# Altium project slave-12-ltc6811-1.PrjPcb (part 1 of 4)
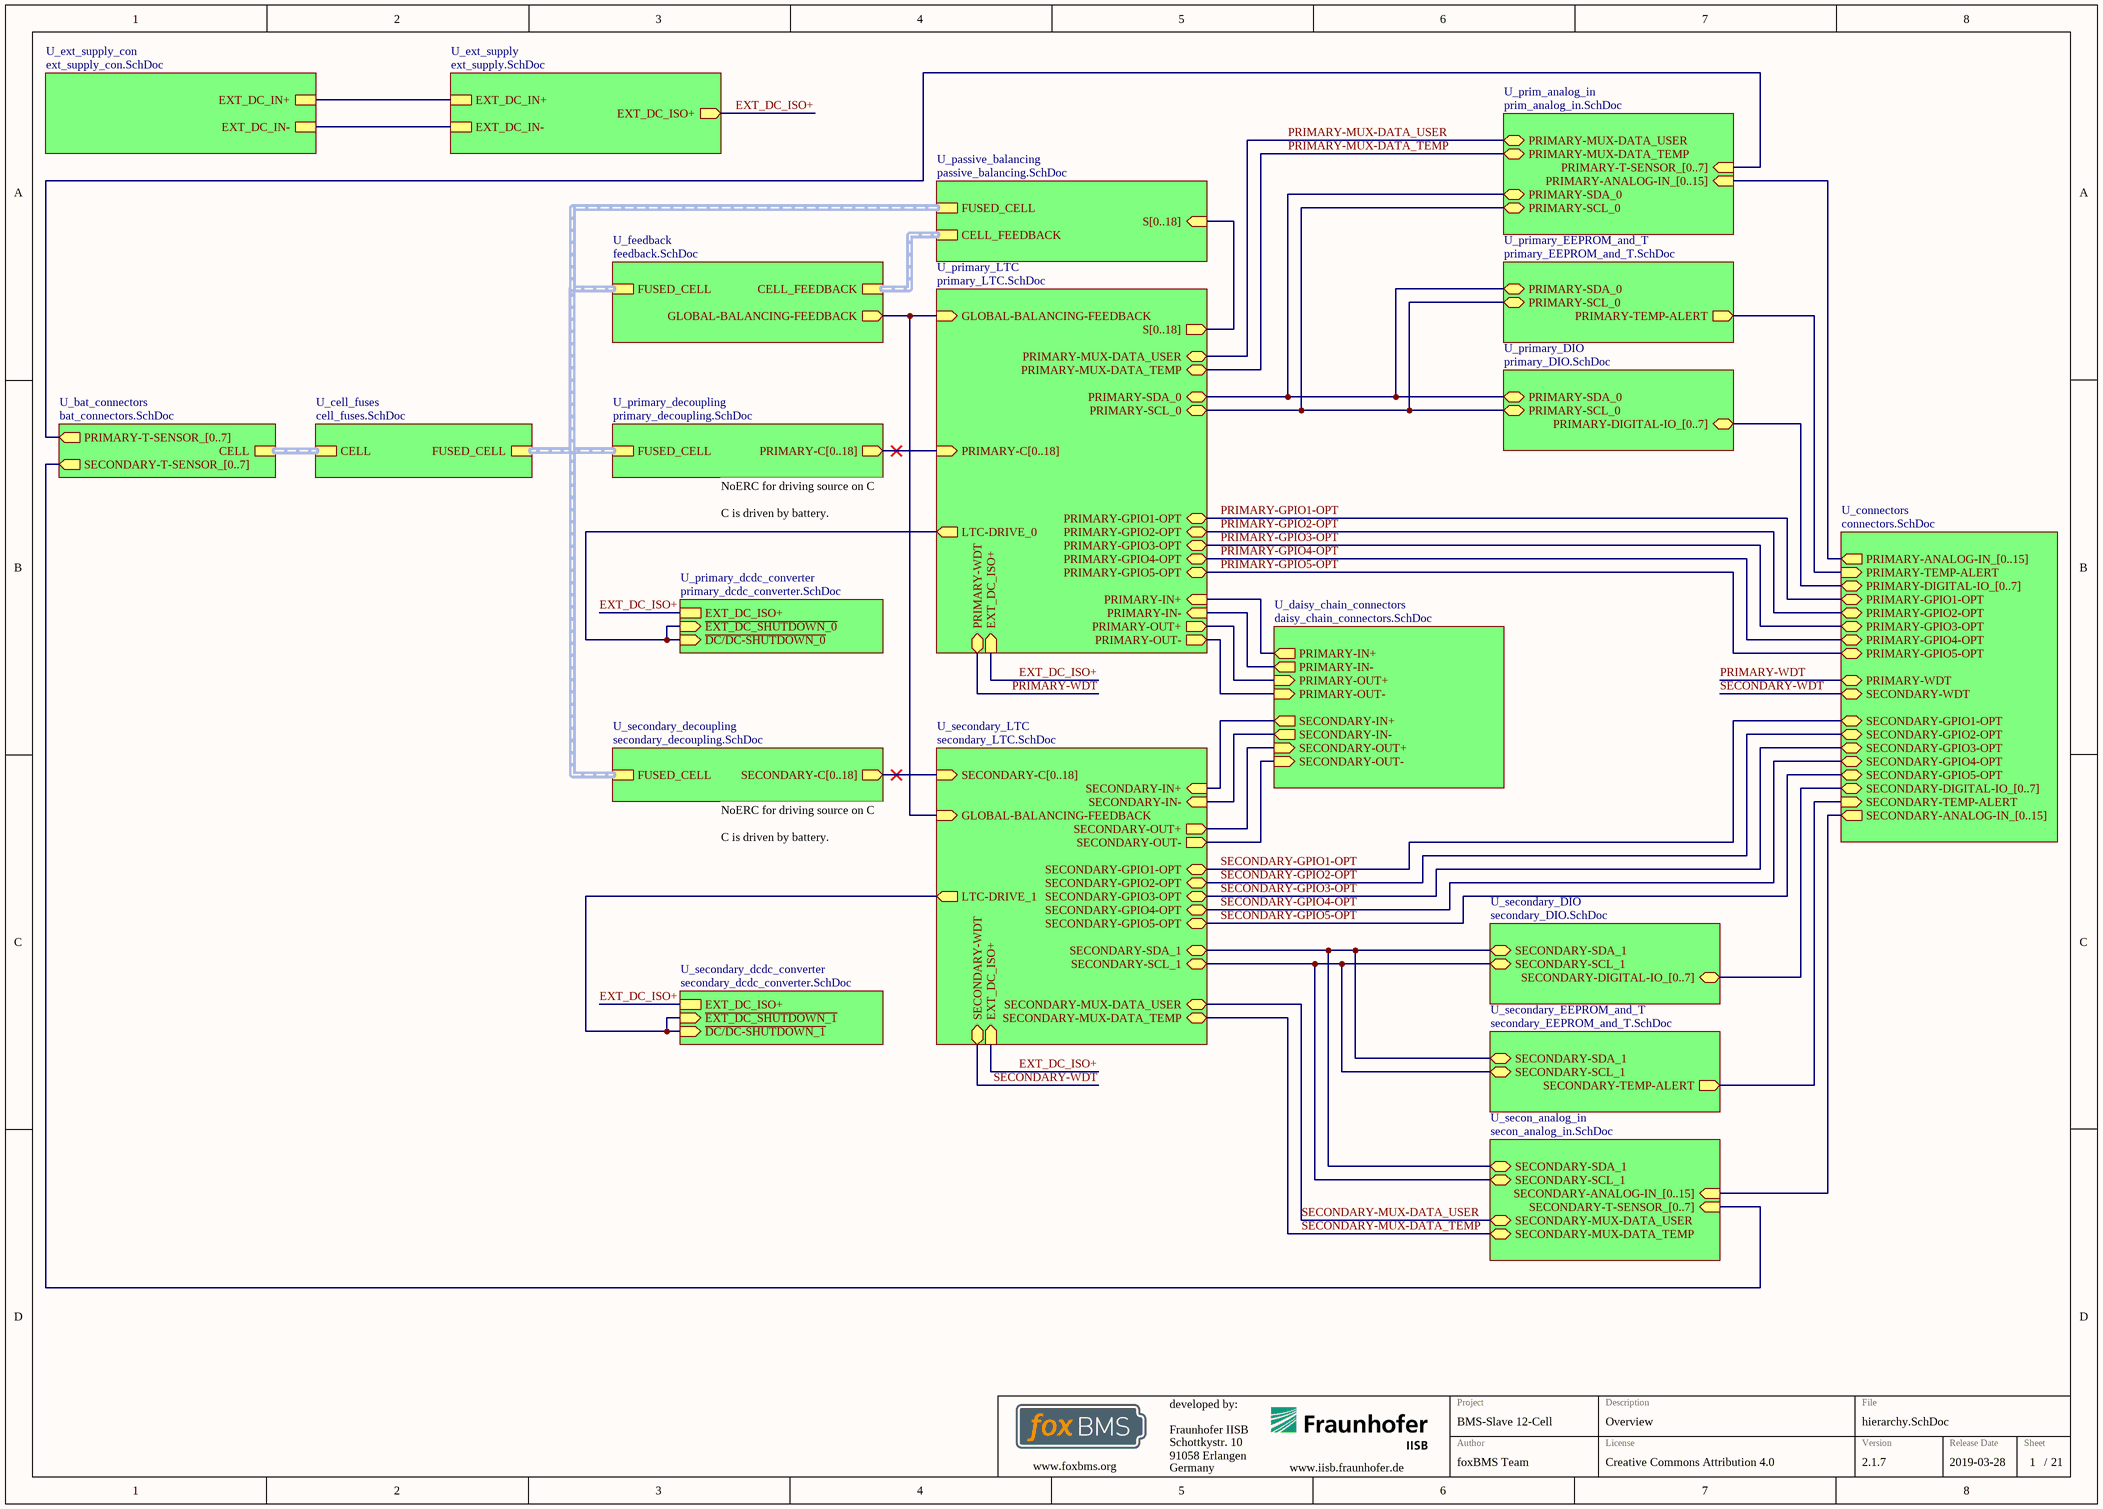
[diagram p0: hierarchy.SchDoc]
GlobalDate: 2019-03-28; GlobalLicense: Creative Commons Attribution 4.0; GlobalProject: BMS-Slave 12-Cell; GlobalVersion: 2.1.7
21 sheets, 488 parts. Net scope: hierarchical (ports join the sheet entries above them; power ports are global).
Board file: slave.PcbDoc
Sheets:
  hierarchy.SchDoc
    U_cell_fuses = cell_fuses.SchDoc
    U_primary_decoupling = primary_decoupling.SchDoc
    U_secondary_decoupling = secondary_decoupling.SchDoc
    U_ext_supply = ext_supply.SchDoc
    U_connectors = connectors.SchDoc
    U_feedback = feedback.SchDoc
    U_passive_balancing = passive_balancing.SchDoc
    U_primary_LTC = primary_LTC.SchDoc
    U_secondary_LTC = secondary_LTC.SchDoc
    U_primary_DIO = primary_DIO.SchDoc
    U_secondary_DIO = secondary_DIO.SchDoc
    U_primary_EEPROM_and_T = primary_EEPROM_and_T.SchDoc
    U_secondary_EEPROM_and_T = secondary_EEPROM_and_T.SchDoc
    U_prim_analog_in = prim_analog_in.SchDoc
    U_secon_analog_in = secon_analog_in.SchDoc
    U_daisy_chain_connectors = daisy_chain_connectors.SchDoc
    U_ext_supply_con = ext_supply_con.SchDoc
    U_bat_connectors = bat_connectors.SchDoc
    U_primary_dcdc_converter = primary_dcdc_converter.SchDoc
    U_secondary_dcdc_converter = secondary_dcdc_converter.SchDoc

## Sheet hierarchy.SchDoc
size A3; DocumentNumber: 1; SheetNumber: 1; SheetTotal: 21; SheetDescription: Overview

### Sub-sheets
U_bat_connectors = bat_connectors.SchDoc: CELL (harness CELL_VOLTAGES), PRIMARY-T-SENSOR_[0..7] (out), SECONDARY-T-SENSOR_[0..7] (out)
U_cell_fuses = cell_fuses.SchDoc: CELL (harness CELL_VOLTAGES), FUSED_CELL (harness CELL_VOLTAGES)
U_connectors = connectors.SchDoc: PRIMARY-WDT (bidir), SECONDARY-WDT (bidir), PRIMARY-GPIO1-OPT (bidir), PRIMARY-GPIO2-OPT (bidir), PRIMARY-GPIO3-OPT (bidir), PRIMARY-GPIO4-OPT (bidir), PRIMARY-GPIO5-OPT (bidir), SECONDARY-GPIO1-OPT (bidir), SECONDARY-GPIO2-OPT (bidir), SECONDARY-GPIO3-OPT (bidir), SECONDARY-GPIO4-OPT (bidir), SECONDARY-GPIO5-OPT (bidir), PRIMARY-TEMP-ALERT (in), SECONDARY-TEMP-ALERT (in), SECONDARY-DIGITAL-IO_[0..7] (bidir), PRIMARY-DIGITAL-IO_[0..7] (bidir), PRIMARY-ANALOG-IN_[0..15] (out), SECONDARY-ANALOG-IN_[0..15] (out)
U_daisy_chain_connectors = daisy_chain_connectors.SchDoc: SECONDARY-IN+ (out), SECONDARY-IN- (out), SECONDARY-OUT+ (in), SECONDARY-OUT- (in), PRIMARY-IN+ (out), PRIMARY-IN- (out), PRIMARY-OUT- (in), PRIMARY-OUT+ (in)
U_ext_supply = ext_supply.SchDoc: EXT_DC_IN+, EXT_DC_IN-, EXT_DC_ISO+ (out)
U_ext_supply_con = ext_supply_con.SchDoc: EXT_DC_IN+, EXT_DC_IN-
U_feedback = feedback.SchDoc: GLOBAL-BALANCING-FEEDBACK (out), CELL_FEEDBACK (harness CELL_FEEDBACK), FUSED_CELL (harness CELL_VOLTAGES)
U_passive_balancing = passive_balancing.SchDoc: FUSED_CELL (harness CELL_VOLTAGES), S[0..18] (in), CELL_FEEDBACK (harness CELL_FEEDBACK)
U_prim_analog_in = prim_analog_in.SchDoc: PRIMARY-MUX-DATA_TEMP (bidir), PRIMARY-MUX-DATA_USER (bidir), PRIMARY-ANALOG-IN_[0..15] (in), PRIMARY-T-SENSOR_[0..7] (in), PRIMARY-SCL_0 (bidir), PRIMARY-SDA_0 (bidir)
U_primary_dcdc_converter = primary_dcdc_converter.SchDoc: ~{EXT_DC_SHUTDOWN_0} (in), EXT_DC_ISO+, ~{DC/DC-SHUTDOWN_0} (in)
U_primary_decoupling = primary_decoupling.SchDoc: FUSED_CELL (harness CELL_VOLTAGES), PRIMARY-C[0..18] (out)
U_primary_DIO = primary_DIO.SchDoc: PRIMARY-SCL_0 (bidir), PRIMARY-SDA_0 (bidir), PRIMARY-DIGITAL-IO_[0..7] (bidir)
U_primary_EEPROM_and_T = primary_EEPROM_and_T.SchDoc: PRIMARY-TEMP-ALERT (out), PRIMARY-SCL_0 (bidir), PRIMARY-SDA_0 (bidir)
U_primary_LTC = primary_LTC.SchDoc: PRIMARY-IN- (in), PRIMARY-IN+ (in), PRIMARY-OUT- (out), PRIMARY-OUT+ (out), PRIMARY-GPIO5-OPT (bidir), PRIMARY-GPIO4-OPT (bidir), PRIMARY-MUX-DATA_USER (bidir), PRIMARY-GPIO1-OPT (bidir), PRIMARY-SCL_0 (bidir), PRIMARY-GPIO2-OPT (bidir), PRIMARY-MUX-DATA_TEMP (bidir), PRIMARY-GPIO3-OPT (bidir), GLOBAL-BALANCING-FEEDBACK (in), PRIMARY-SDA_0 (bidir), EXT_DC_ISO+ (in), PRIMARY-C[0..18] (in), S[0..18] (out), PRIMARY-WDT (bidir), LTC-DRIVE_0 (out)
U_secon_analog_in = secon_analog_in.SchDoc: SECONDARY-MUX-DATA_TEMP (bidir), SECONDARY-MUX-DATA_USER (bidir), SECONDARY-ANALOG-IN_[0..15] (in), SECONDARY-T-SENSOR_[0..7] (in), SECONDARY-SCL_1 (bidir), SECONDARY-SDA_1 (bidir)
U_secondary_dcdc_converter = secondary_dcdc_converter.SchDoc: EXT_DC_ISO+, ~{EXT_DC_SHUTDOWN_1} (in), ~{DC/DC-SHUTDOWN_1} (in)
U_secondary_decoupling = secondary_decoupling.SchDoc: FUSED_CELL (harness CELL_VOLTAGES), SECONDARY-C[0..18] (out)
U_secondary_DIO = secondary_DIO.SchDoc: SECONDARY-SCL_1 (bidir), SECONDARY-SDA_1 (bidir), SECONDARY-DIGITAL-IO_[0..7] (bidir)
U_secondary_EEPROM_and_T = secondary_EEPROM_and_T.SchDoc: SECONDARY-TEMP-ALERT (out), SECONDARY-SDA_1 (bidir), SECONDARY-SCL_1 (bidir)
U_secondary_LTC = secondary_LTC.SchDoc: SECONDARY-GPIO5-OPT (bidir), SECONDARY-GPIO4-OPT (bidir), SECONDARY-MUX-DATA_USER (bidir), SECONDARY-GPIO1-OPT (bidir), SECONDARY-SDA_1 (bidir), SECONDARY-SCL_1 (bidir), SECONDARY-MUX-DATA_TEMP (bidir), SECONDARY-GPIO2-OPT (bidir), SECONDARY-GPIO3-OPT (bidir), GLOBAL-BALANCING-FEEDBACK (in), EXT_DC_ISO+ (in), SECONDARY-IN- (in), SECONDARY-IN+ (in), SECONDARY-OUT- (out), SECONDARY-OUT+ (out), SECONDARY-C[0..18] (in), SECONDARY-WDT (bidir), LTC-DRIVE_1 (out)

### Nets
EXT_DC_IN+: sheet U_ext_supply/EXT_DC_IN+, sheet U_ext_supply_con/EXT_DC_IN+
EXT_DC_IN-: sheet U_ext_supply/EXT_DC_IN-, sheet U_ext_supply_con/EXT_DC_IN-
EXT_DC_ISO+: sheet U_ext_supply/EXT_DC_ISO+, sheet U_primary_LTC/EXT_DC_ISO+, sheet U_secondary_LTC/EXT_DC_ISO+, sheet U_primary_dcdc_converter/EXT_DC_ISO+, sheet U_secondary_dcdc_converter/EXT_DC_ISO+
GLOBAL-BALANCING-FEEDBACK: sheet U_feedback/GLOBAL-BALANCING-FEEDBACK, sheet U_primary_LTC/GLOBAL-BALANCING-FEEDBACK, sheet U_secondary_LTC/GLOBAL-BALANCING-FEEDBACK
LTC-Drive_0: sheet U_primary_LTC/LTC-DRIVE_0, sheet U_primary_dcdc_converter/~{EXT_DC_SHUTDOWN_0}, sheet U_primary_dcdc_converter/~{DC/DC-SHUTDOWN_0}
LTC-Drive_1: sheet U_secondary_LTC/LTC-DRIVE_1, sheet U_secondary_dcdc_converter/~{EXT_DC_SHUTDOWN_1}, sheet U_secondary_dcdc_converter/~{DC/DC-SHUTDOWN_1}
PRIMARY-GPIO1-OPT: sheet U_connectors/PRIMARY-GPIO1-OPT, sheet U_primary_LTC/PRIMARY-GPIO1-OPT
PRIMARY-GPIO2-OPT: sheet U_connectors/PRIMARY-GPIO2-OPT, sheet U_primary_LTC/PRIMARY-GPIO2-OPT
PRIMARY-GPIO3-OPT: sheet U_connectors/PRIMARY-GPIO3-OPT, sheet U_primary_LTC/PRIMARY-GPIO3-OPT
PRIMARY-GPIO4-OPT: sheet U_connectors/PRIMARY-GPIO4-OPT, sheet U_primary_LTC/PRIMARY-GPIO4-OPT
PRIMARY-GPIO5-OPT: sheet U_connectors/PRIMARY-GPIO5-OPT, sheet U_primary_LTC/PRIMARY-GPIO5-OPT
PRIMARY-IN+: sheet U_primary_LTC/PRIMARY-IN+, sheet U_daisy_chain_connectors/PRIMARY-IN+
PRIMARY-IN-: sheet U_primary_LTC/PRIMARY-IN-, sheet U_daisy_chain_connectors/PRIMARY-IN-
PRIMARY-MUX-DATA_TEMP: sheet U_primary_LTC/PRIMARY-MUX-DATA_TEMP, sheet U_prim_analog_in/PRIMARY-MUX-DATA_TEMP
PRIMARY-MUX-DATA_USER: sheet U_primary_LTC/PRIMARY-MUX-DATA_USER, sheet U_prim_analog_in/PRIMARY-MUX-DATA_USER
PRIMARY-OUT+: sheet U_primary_LTC/PRIMARY-OUT+, sheet U_daisy_chain_connectors/PRIMARY-OUT+
PRIMARY-OUT-: sheet U_primary_LTC/PRIMARY-OUT-, sheet U_daisy_chain_connectors/PRIMARY-OUT-
PRIMARY-SCL_0: sheet U_primary_LTC/PRIMARY-SCL_0, sheet U_primary_DIO/PRIMARY-SCL_0, sheet U_primary_EEPROM_and_T/PRIMARY-SCL_0, sheet U_prim_analog_in/PRIMARY-SCL_0
PRIMARY-SDA_0: sheet U_primary_LTC/PRIMARY-SDA_0, sheet U_primary_DIO/PRIMARY-SDA_0, sheet U_primary_EEPROM_and_T/PRIMARY-SDA_0, sheet U_prim_analog_in/PRIMARY-SDA_0
PRIMARY-TEMP-ALERT: sheet U_connectors/PRIMARY-TEMP-ALERT, sheet U_primary_EEPROM_and_T/PRIMARY-TEMP-ALERT
PRIMARY-WDT: sheet U_connectors/PRIMARY-WDT, sheet U_primary_LTC/PRIMARY-WDT
SECONDARY-GPIO1-OPT: sheet U_connectors/SECONDARY-GPIO1-OPT, sheet U_secondary_LTC/SECONDARY-GPIO1-OPT
SECONDARY-GPIO2-OPT: sheet U_connectors/SECONDARY-GPIO2-OPT, sheet U_secondary_LTC/SECONDARY-GPIO2-OPT
SECONDARY-GPIO3-OPT: sheet U_connectors/SECONDARY-GPIO3-OPT, sheet U_secondary_LTC/SECONDARY-GPIO3-OPT
SECONDARY-GPIO4-OPT: sheet U_connectors/SECONDARY-GPIO4-OPT, sheet U_secondary_LTC/SECONDARY-GPIO4-OPT
SECONDARY-GPIO5-OPT: sheet U_connectors/SECONDARY-GPIO5-OPT, sheet U_secondary_LTC/SECONDARY-GPIO5-OPT
SECONDARY-IN+: sheet U_secondary_LTC/SECONDARY-IN+, sheet U_daisy_chain_connectors/SECONDARY-IN+
SECONDARY-IN-: sheet U_secondary_LTC/SECONDARY-IN-, sheet U_daisy_chain_connectors/SECONDARY-IN-
SECONDARY-MUX-DATA_TEMP: sheet U_secondary_LTC/SECONDARY-MUX-DATA_TEMP, sheet U_secon_analog_in/SECONDARY-MUX-DATA_TEMP
SECONDARY-MUX-DATA_USER: sheet U_secondary_LTC/SECONDARY-MUX-DATA_USER, sheet U_secon_analog_in/SECONDARY-MUX-DATA_USER
SECONDARY-OUT+: sheet U_secondary_LTC/SECONDARY-OUT+, sheet U_daisy_chain_connectors/SECONDARY-OUT+
SECONDARY-OUT-: sheet U_secondary_LTC/SECONDARY-OUT-, sheet U_daisy_chain_connectors/SECONDARY-OUT-
SECONDARY-SCL_1: sheet U_secondary_LTC/SECONDARY-SCL_1, sheet U_secondary_DIO/SECONDARY-SCL_1, sheet U_secondary_EEPROM_and_T/SECONDARY-SCL_1, sheet U_secon_analog_in/SECONDARY-SCL_1
SECONDARY-SDA_1: sheet U_secondary_LTC/SECONDARY-SDA_1, sheet U_secondary_DIO/SECONDARY-SDA_1, sheet U_secondary_EEPROM_and_T/SECONDARY-SDA_1, sheet U_secon_analog_in/SECONDARY-SDA_1
SECONDARY-TEMP-ALERT: sheet U_connectors/SECONDARY-TEMP-ALERT, sheet U_secondary_EEPROM_and_T/SECONDARY-TEMP-ALERT
SECONDARY-WDT: sheet U_connectors/SECONDARY-WDT, sheet U_secondary_LTC/SECONDARY-WDT

### Buses and harness runs
bus sheet U_bat_connectors/PRIMARY-T-SENSOR_[0..7] = sheet U_prim_analog_in/PRIMARY-T-SENSOR_[0..7]
bus sheet U_bat_connectors/SECONDARY-T-SENSOR_[0..7] = sheet U_secon_analog_in/SECONDARY-T-SENSOR_[0..7]
bus sheet U_connectors/PRIMARY-ANALOG-IN_[0..15] = sheet U_prim_analog_in/PRIMARY-ANALOG-IN_[0..15]
bus sheet U_connectors/PRIMARY-DIGITAL-IO_[0..7] = sheet U_primary_DIO/PRIMARY-DIGITAL-IO_[0..7]
bus sheet U_connectors/SECONDARY-ANALOG-IN_[0..15] = sheet U_secon_analog_in/SECONDARY-ANALOG-IN_[0..15]
bus sheet U_connectors/SECONDARY-DIGITAL-IO_[0..7] = sheet U_secondary_DIO/SECONDARY-DIGITAL-IO_[0..7]
bus sheet U_passive_balancing/S[0..18] = sheet U_primary_LTC/S[0..18]
bus sheet U_primary_decoupling/PRIMARY-C[0..18] = sheet U_primary_LTC/PRIMARY-C[0..18]
bus sheet U_secondary_decoupling/SECONDARY-C[0..18] = sheet U_secondary_LTC/SECONDARY-C[0..18]
harness sheet U_bat_connectors/CELL = sheet U_cell_fuses/CELL
harness sheet U_cell_fuses/FUSED_CELL = sheet U_feedback/FUSED_CELL = sheet U_passive_balancing/FUSED_CELL = sheet U_primary_decoupling/FUSED_CELL = sheet U_secondary_decoupling/FUSED_CELL
harness sheet U_feedback/CELL_FEEDBACK = sheet U_passive_balancing/CELL_FEEDBACK

### Notes on the sheet
- NoERC for driving source on C
  C is driven by battery.
- Fraunhofer IISB
- Schottkystr. 10
- developed by:
- 91058 Erlangen
- Germany
- Author
- Project
- License
- Description
- File
- Version
- Release Date
- Sheet
- www.foxbms.org
- www.iisb.fraunhofer.de
- foxBMS Team
- /

## Sheet cell_fuses.SchDoc: foxBMS BMS-Slave 12-Cell
size A3; DocumentNumber: 3; SheetNumber: 3; SheetTotal: 21; AUTHOR: Fraunhofer IISB foxBMS Team; SheetDescription: Cell Voltage Sense Fuses
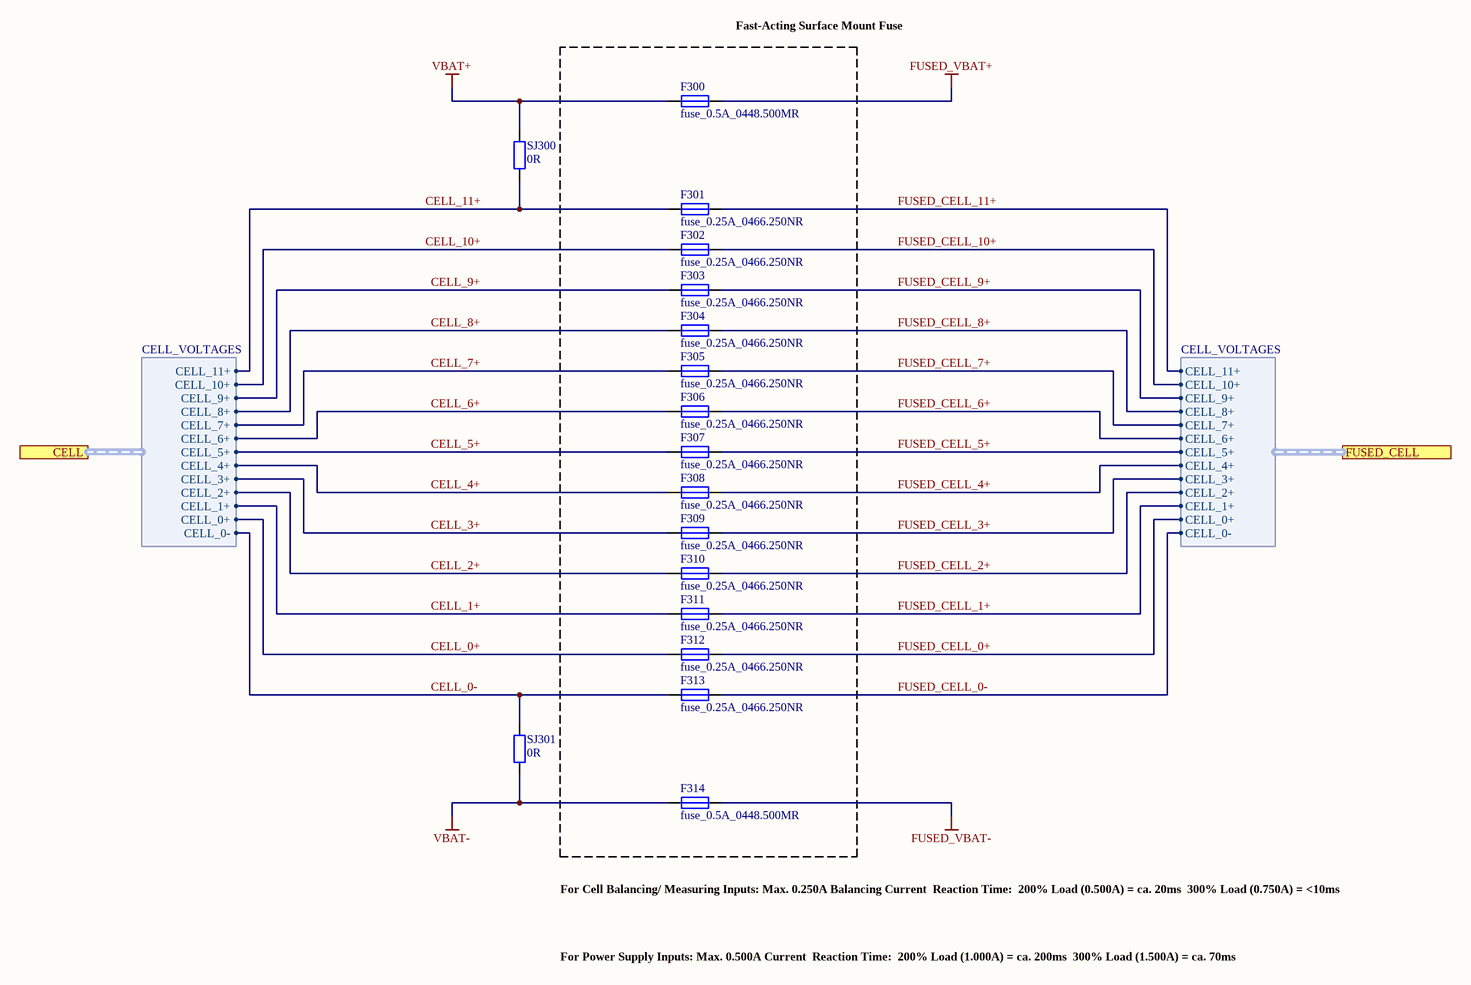
[diagram p1: cell_fuses.SchDoc]

### Parts
F300  fuse_0.5A_0448.500MR  [LITTLEFUSE_448]
F301  fuse_0.25A_0466.250NR  [LITTLEFUSE_466]
F302  fuse_0.25A_0466.250NR  [LITTLEFUSE_466]
F303  fuse_0.25A_0466.250NR  [LITTLEFUSE_466]
F304  fuse_0.25A_0466.250NR  [LITTLEFUSE_466]
F305  fuse_0.25A_0466.250NR  [LITTLEFUSE_466]
F306  fuse_0.25A_0466.250NR  [LITTLEFUSE_466]
F307  fuse_0.25A_0466.250NR  [LITTLEFUSE_466]
F308  fuse_0.25A_0466.250NR  [LITTLEFUSE_466]
F309  fuse_0.25A_0466.250NR  [LITTLEFUSE_466]
F310  fuse_0.25A_0466.250NR  [LITTLEFUSE_466]
F311  fuse_0.25A_0466.250NR  [LITTLEFUSE_466]
F312  fuse_0.25A_0466.250NR  [LITTLEFUSE_466]
F313  fuse_0.25A_0466.250NR  [LITTLEFUSE_466]
F314  fuse_0.5A_0448.500MR  [LITTLEFUSE_448]
SJ300  0R  [RESC1608X05N]
SJ301  0R  [RESC1608X05N]

### Blocks framed on the sheet
Fast-Acting Surface Mount Fuse: F300-F314

### Ports
CELL (harness CELL_VOLTAGES), FUSED_CELL (harness CELL_VOLTAGES)

### Harnesses
CELL_VOLTAGES: CELL_0-, CELL_0+, CELL_1+, CELL_10+, CELL_11+, CELL_2+, CELL_3+, CELL_4+, CELL_5+, CELL_6+, CELL_7+, CELL_8+, CELL_9+

### Nets
FUSED_VBAT+: F300.2
FUSED_VBAT-: F314.2
VBAT+: F300.1 SJ300.1
VBAT-: F314.1 SJ301.2
CELL_0+: F312.1 ; port CELL.CELL_0+
CELL_0-: F313.1 SJ301.1 ; port CELL.CELL_0-
CELL_1+: F311.1 ; port CELL.CELL_1+
CELL_2+: F310.1 ; port CELL.CELL_2+
CELL_3+: F309.1 ; port CELL.CELL_3+
CELL_4+: F308.1 ; port CELL.CELL_4+
CELL_5+: F307.1 ; port CELL.CELL_5+
CELL_6+: F306.1 ; port CELL.CELL_6+
CELL_7+: F305.1 ; port CELL.CELL_7+
CELL_8+: F304.1 ; port CELL.CELL_8+
CELL_9+: F303.1 ; port CELL.CELL_9+
CELL_10+: F302.1 ; port CELL.CELL_10+
CELL_11+: F301.1 SJ300.2 ; port CELL.CELL_11+
FUSED_CELL_0+: F312.2 ; port FUSED_CELL.CELL_0+
FUSED_CELL_0-: F313.2 ; port FUSED_CELL.CELL_0-
FUSED_CELL_1+: F311.2 ; port FUSED_CELL.CELL_1+
FUSED_CELL_2+: F310.2 ; port FUSED_CELL.CELL_2+
FUSED_CELL_3+: F309.2 ; port FUSED_CELL.CELL_3+
FUSED_CELL_4+: F308.2 ; port FUSED_CELL.CELL_4+
FUSED_CELL_5+: F307.2 ; port FUSED_CELL.CELL_5+
FUSED_CELL_6+: F306.2 ; port FUSED_CELL.CELL_6+
FUSED_CELL_7+: F305.2 ; port FUSED_CELL.CELL_7+
FUSED_CELL_8+: F304.2 ; port FUSED_CELL.CELL_8+
FUSED_CELL_9+: F303.2 ; port FUSED_CELL.CELL_9+
FUSED_CELL_10+: F302.2 ; port FUSED_CELL.CELL_10+
FUSED_CELL_11+: F301.2 ; port FUSED_CELL.CELL_11+

### Notes on the sheet
- For Cell Balancing/ Measuring Inputs: Max. 0.250A Balancing Current
  Reaction Time:
  200% Load (0.500A) = ca. 20ms
  300% Load (0.750A) = <10ms
- For Power Supply Inputs: Max. 0.500A Current
  Reaction Time:
  200% Load (1.000A) = ca. 200ms
  300% Load (1.500A) = ca. 70ms
- Fraunhofer IISB
- Schottkystr. 10
- developed by:
- 91058 Erlangen
- Germany
- Author
- Project
- License
- Description
- File
- Version
- Release Date
- Sheet
- www.foxbms.org
- www.iisb.fraunhofer.de
- foxBMS Team
- /

### Library data of the parts
F300 F314 = fuse_0.5A_0448.500MR: Fuse, Surface Mount, NANO2 Series, 500 mA, 125 VAC, 32 VDC, Very Fast Acting, SMD; Manufacturer: Littlefuse; Automotive Qualified: False; Part Number: fuse_0.5A_0448.500MR; Operating Temperature: -55°C - +125°C; ComponentLink1Description: Datasheet; ComponentLink1URL: http://www.farnell.com/datasheets/1792947.pdf; Supplier 1: Farnell; Supplier Part Number 1: 1596919
F301-F313 = fuse_0.25A_0466.250NR: Fuse, Surface Mount, 466 Series, 250 mA, 125 VAC, 125 VDC, Very Fast Acting, 1206; Manufacturer: Littlefuse; Automotive Qualified: False; Part Number: fuse_0.25A_0466.250NR; Operating Temperature: -55°C - +90°C; ComponentLink1Description: Datasheet; ComponentLink1URL: http://www.farnell.com/datasheets/1796765.pdf; Supplier 1: Farnell; Supplier Part Number 1: 9921826
SJ300 SJ301 = gen_R_0R_0603: SMD Resistor 0R 0603; Power: 0.1W; Case EIA: 0603; Case Metric: 1608; Maximum Working Voltage: 75V; PnP Package: R_0603; Automotive Qualified: False; Part Number: gen_R_0R_0603; Operating Temperature: -55°C - +155°C; Resistance: 0R; Series: Jumper; PnP Value: 0R; Supplier 1: Farnell; Supplier Part Number 1: 2073345

## Sheet primary_decoupling.SchDoc: foxBMS BMS-Slave 12-Cell
size A3; DocumentNumber: 12; SheetNumber: 12; SheetTotal: 21; AUTHOR: Fraunhofer IISB foxBMS Team; SheetDescription: Primary Voltage Measurement
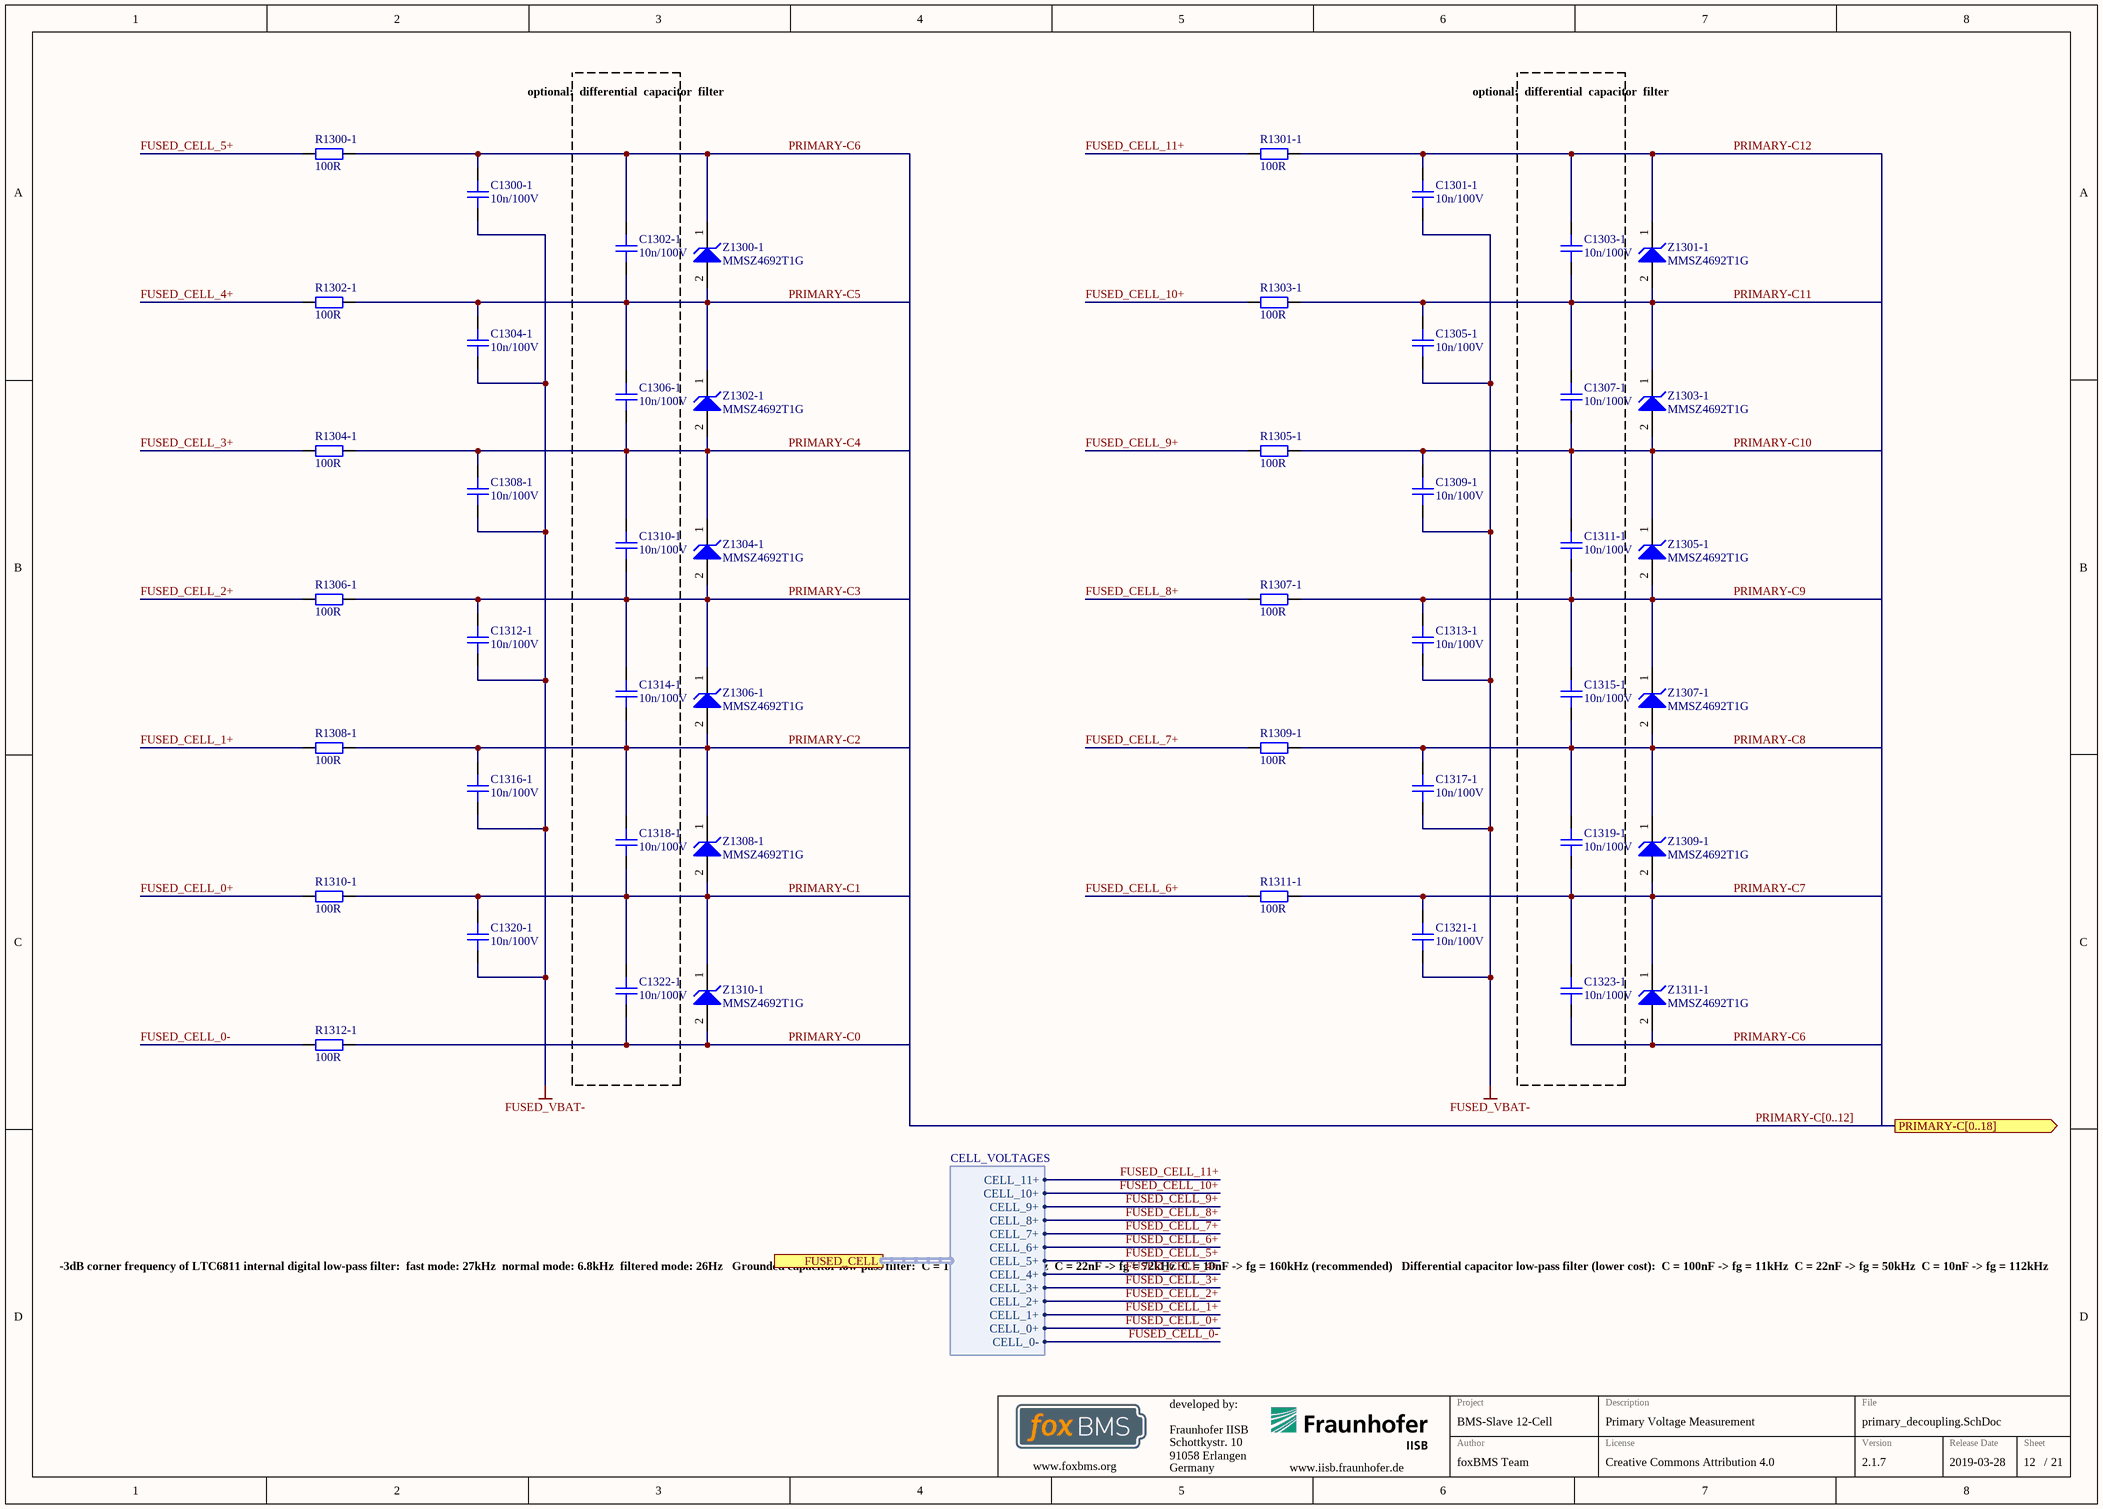
[diagram p2: primary_decoupling.SchDoc]

### Parts
C1300-1  10n/100V  [CAPC1608X08N]
C1301-1  10n/100V  [CAPC1608X08N]
C1302-1  10n/100V  [CAPC1608X08N]
C1303-1  10n/100V  [CAPC1608X08N]
C1304-1  10n/100V  [CAPC1608X08N]
C1305-1  10n/100V  [CAPC1608X08N]
C1306-1  10n/100V  [CAPC1608X08N]
C1307-1  10n/100V  [CAPC1608X08N]
C1308-1  10n/100V  [CAPC1608X08N]
C1309-1  10n/100V  [CAPC1608X08N]
C1310-1  10n/100V  [CAPC1608X08N]
C1311-1  10n/100V  [CAPC1608X08N]
C1312-1  10n/100V  [CAPC1608X08N]
C1313-1  10n/100V  [CAPC1608X08N]
C1314-1  10n/100V  [CAPC1608X08N]
C1315-1  10n/100V  [CAPC1608X08N]
C1316-1  10n/100V  [CAPC1608X08N]
C1317-1  10n/100V  [CAPC1608X08N]
C1318-1  10n/100V  [CAPC1608X08N]
C1319-1  10n/100V  [CAPC1608X08N]
C1320-1  10n/100V  [CAPC1608X08N]
C1321-1  10n/100V  [CAPC1608X08N]
C1322-1  10n/100V  [CAPC1608X08N]
C1323-1  10n/100V  [CAPC1608X08N]
R1300-1  100R  [RESC1608X05N]
R1301-1  100R  [RESC1608X05N]
R1302-1  100R  [RESC1608X05N]
R1303-1  100R  [RESC1608X05N]
R1304-1  100R  [RESC1608X05N]
R1305-1  100R  [RESC1608X05N]
R1306-1  100R  [RESC1608X05N]
R1307-1  100R  [RESC1608X05N]
R1308-1  100R  [RESC1608X05N]
R1309-1  100R  [RESC1608X05N]
R1310-1  100R  [RESC1608X05N]
R1311-1  100R  [RESC1608X05N]
R1312-1  100R  [RESC1608X05N]
Z1300-1  MMSZ4692T1G  [ONSC-SOD-123-2-425-04_V]
Z1301-1  MMSZ4692T1G  [ONSC-SOD-123-2-425-04_V]
Z1302-1  MMSZ4692T1G  [ONSC-SOD-123-2-425-04_V]
Z1303-1  MMSZ4692T1G  [ONSC-SOD-123-2-425-04_V]
Z1304-1  MMSZ4692T1G  [ONSC-SOD-123-2-425-04_V]
Z1305-1  MMSZ4692T1G  [ONSC-SOD-123-2-425-04_V]
Z1306-1  MMSZ4692T1G  [ONSC-SOD-123-2-425-04_V]
Z1307-1  MMSZ4692T1G  [ONSC-SOD-123-2-425-04_V]
Z1308-1  MMSZ4692T1G  [ONSC-SOD-123-2-425-04_V]
Z1309-1  MMSZ4692T1G  [ONSC-SOD-123-2-425-04_V]
Z1310-1  MMSZ4692T1G  [ONSC-SOD-123-2-425-04_V]
Z1311-1  MMSZ4692T1G  [ONSC-SOD-123-2-425-04_V]

### Blocks framed on the sheet
optional: / differential / capacitor / filter: C1302-1 C1306-1 C1310-1 C1314-1 C1318-1 C1322-1
optional: / differential / capacitor / filter: C1303-1 C1307-1 C1311-1 C1315-1 C1319-1 C1323-1

### Ports
FUSED_CELL (harness CELL_VOLTAGES), PRIMARY-C[0..18] (out)

### Harnesses
CELL_VOLTAGES: CELL_0-, CELL_0+, CELL_1+, CELL_10+, CELL_11+, CELL_2+, CELL_3+, CELL_4+, CELL_5+, CELL_6+, CELL_7+, CELL_8+, CELL_9+

### Nets
FUSED_VBAT-: C1300-1.2 C1301-1.2 C1304-1.2 C1305-1.2 C1308-1.2 C1309-1.2 C1312-1.2 C1313-1.2 C1316-1.2 C1317-1.2 C1320-1.2 C1321-1.2
FUSED_CELL_0+: R1310-1.1 ; port FUSED_CELL.CELL_0+
FUSED_CELL_0-: R1312-1.1 ; port FUSED_CELL.CELL_0-
FUSED_CELL_1+: R1308-1.1 ; port FUSED_CELL.CELL_1+
FUSED_CELL_2+: R1306-1.1 ; port FUSED_CELL.CELL_2+
FUSED_CELL_3+: R1304-1.1 ; port FUSED_CELL.CELL_3+
FUSED_CELL_4+: R1302-1.1 ; port FUSED_CELL.CELL_4+
FUSED_CELL_5+: R1300-1.1 ; port FUSED_CELL.CELL_5+
FUSED_CELL_6+: R1311-1.1 ; port FUSED_CELL.CELL_6+
FUSED_CELL_7+: R1309-1.1 ; port FUSED_CELL.CELL_7+
FUSED_CELL_8+: R1307-1.1 ; port FUSED_CELL.CELL_8+
FUSED_CELL_9+: R1305-1.1 ; port FUSED_CELL.CELL_9+
FUSED_CELL_10+: R1303-1.1 ; port FUSED_CELL.CELL_10+
FUSED_CELL_11+: R1301-1.1 ; port FUSED_CELL.CELL_11+
PRIMARY-C0: C1322-1.2 R1312-1.2 Z1310-1.2(A)
PRIMARY-C1: C1318-1.2 C1320-1.1 C1322-1.1 R1310-1.2 Z1308-1.2(A) Z1310-1.1(K)
PRIMARY-C2: C1314-1.2 C1316-1.1 C1318-1.1 R1308-1.2 Z1306-1.2(A) Z1308-1.1(K)
PRIMARY-C3: C1310-1.2 C1312-1.1 C1314-1.1 R1306-1.2 Z1304-1.2(A) Z1306-1.1(K)
PRIMARY-C4: C1306-1.2 C1308-1.1 C1310-1.1 R1304-1.2 Z1302-1.2(A) Z1304-1.1(K)
PRIMARY-C5: C1302-1.2 C1304-1.1 C1306-1.1 R1302-1.2 Z1300-1.2(A) Z1302-1.1(K)
PRIMARY-C6: C1300-1.1 C1302-1.1 C1323-1.2 R1300-1.2 Z1300-1.1(K) Z1311-1.2(A)
PRIMARY-C7: C1319-1.2 C1321-1.1 C1323-1.1 R1311-1.2 Z1309-1.2(A) Z1311-1.1(K)
PRIMARY-C8: C1315-1.2 C1317-1.1 C1319-1.1 R1309-1.2 Z1307-1.2(A) Z1309-1.1(K)
PRIMARY-C9: C1311-1.2 C1313-1.1 C1315-1.1 R1307-1.2 Z1305-1.2(A) Z1307-1.1(K)
PRIMARY-C10: C1307-1.2 C1309-1.1 C1311-1.1 R1305-1.2 Z1303-1.2(A) Z1305-1.1(K)
PRIMARY-C11: C1303-1.2 C1305-1.1 C1307-1.1 R1303-1.2 Z1301-1.2(A) Z1303-1.1(K)
PRIMARY-C12: C1301-1.1 C1303-1.1 R1301-1.2 Z1301-1.1(K)

### Buses and harness runs
bus PRIMARY-C[0..12] = port PRIMARY-C[0..18]

### Notes on the sheet
- -3dB corner frequency of LTC6811 internal digital low-pass filter:
  fast mode: 27kHz
  normal mode: 6.8kHz
  filtered mode: 26Hz
  Grounded capacitor low-pass filter:
  C = 100nF -> fg = 16kHz
  C = 22nF -> fg = 72kHz
  C = 10nF -> fg = 160kHz (recommended)
  Differential capacitor low-pass filter (lower cost):
  C = 100nF -> fg = 11kHz
  C = 22nF -> fg = 50kHz
  C = 10nF -> fg = 112kHz
- Fraunhofer IISB
- Schottkystr. 10
- developed by:
- 91058 Erlangen
- Germany
- Author
- Project
- License
- Description
- File
- Version
- Release Date
- Sheet
- www.foxbms.org
- www.iisb.fraunhofer.de
- foxBMS Team
- /

### Library data of the parts
C1300-1 C1301-1 C1302-1 C1303-1 C1304-1 C1305-1 C1306-1 C1307-1 C1308-1 C1309-1 C1310-1 C1311-1 C1312-1 C1313-1 C1314-1 C1315-1 C1316-1 C1317-1 C1318-1 C1319-1 C1320-1 C1321-1 C1322-1 C1323-1 = gen_C_ceramic_10n_100V_X7R_0603: MLCC; Capacitance: 10n; Rated Voltage: 100V; Dielectric: X7R; Case EIA: 0603; Case Metric: 1608; Automotive Qualified: True; PnP Package: C_0603_10; PnP Value: 10n/100V/X7R; Part Number: gen_C_ceramic_10n_100V_X7R_0603; Supplier 1: Farnell; Supplier Part Number 1: 1301715; Supplier 2: Farnell; Supplier 3: Farnell; Supplier Part Number 2: 2821192; Supplier Part Number 3: 2210878
R1300-1 R1301-1 R1302-1 R1303-1 R1304-1 R1305-1 R1306-1 R1307-1 R1308-1 R1309-1 R1310-1 R1311-1 R1312-1 = gen_R_100R_0603: SMD Resistor 100R 0603; Tolerance: 1%; Power: 0.1W; Case EIA: 0603; Case Metric: 1608; Maximum Working Voltage: 75V; PnP Package: R_0603; Automotive Qualified: False; Part Number: gen_R_100R_0603; Operating Temperature: -55°C - +155°C; Resistance: 100R; Series: E24, E96; PnP Value: 100R; Supplier 1: Farnell; Supplier Part Number 1: 1469752
Z1300-1 Z1301-1 Z1302-1 Z1303-1 Z1304-1 Z1305-1 Z1306-1 Z1307-1 Z1308-1 Z1309-1 Z1310-1 Z1311-1 = CMP-1060-00434-1: Zener Voltage Regulator, 500 mW, 2-Pin SOD-123, Pb-Free, Tape and Reel; Manufacturer: On Semiconductor; VZ Typ (V): 6.8; P Max (W): 0.5; ComponentLink2URL: http://www.onsemi.com/pub_link/Collateral/MMSZ4678T1-D.PDF; Mounting Technology: Surface Mount; DatasheetVersion: Rev. 9; ComponentLink1Description: Manufacturer URL; ComponentLink3URL: http://www.onsemi.com/pub_link/Collateral/425-04.PDF; PackageReference: SOD-123-2-425-04; ComponentLink2Description: Datasheet; RoHS: Pb-Free; Packing: Tape and Reel; ComponentLink1URL: http://www.onsemi.com/; PackageDescription: 2-Pin SOD, Body 1.6 x 2.69 mm; ComponentLink3Description: Package Specification; PartNumber: MMSZ4692T1G; PackageVersion: Rev. G, 10/2009

## Sheet secondary_decoupling.SchDoc: foxBMS BMS-Slave 12-Cell
size A3; DocumentNumber: 18; SheetNumber: 18; SheetTotal: 21; AUTHOR: Fraunhofer IISB foxBMS Team; SheetDescription: Secondary Voltage Measurement
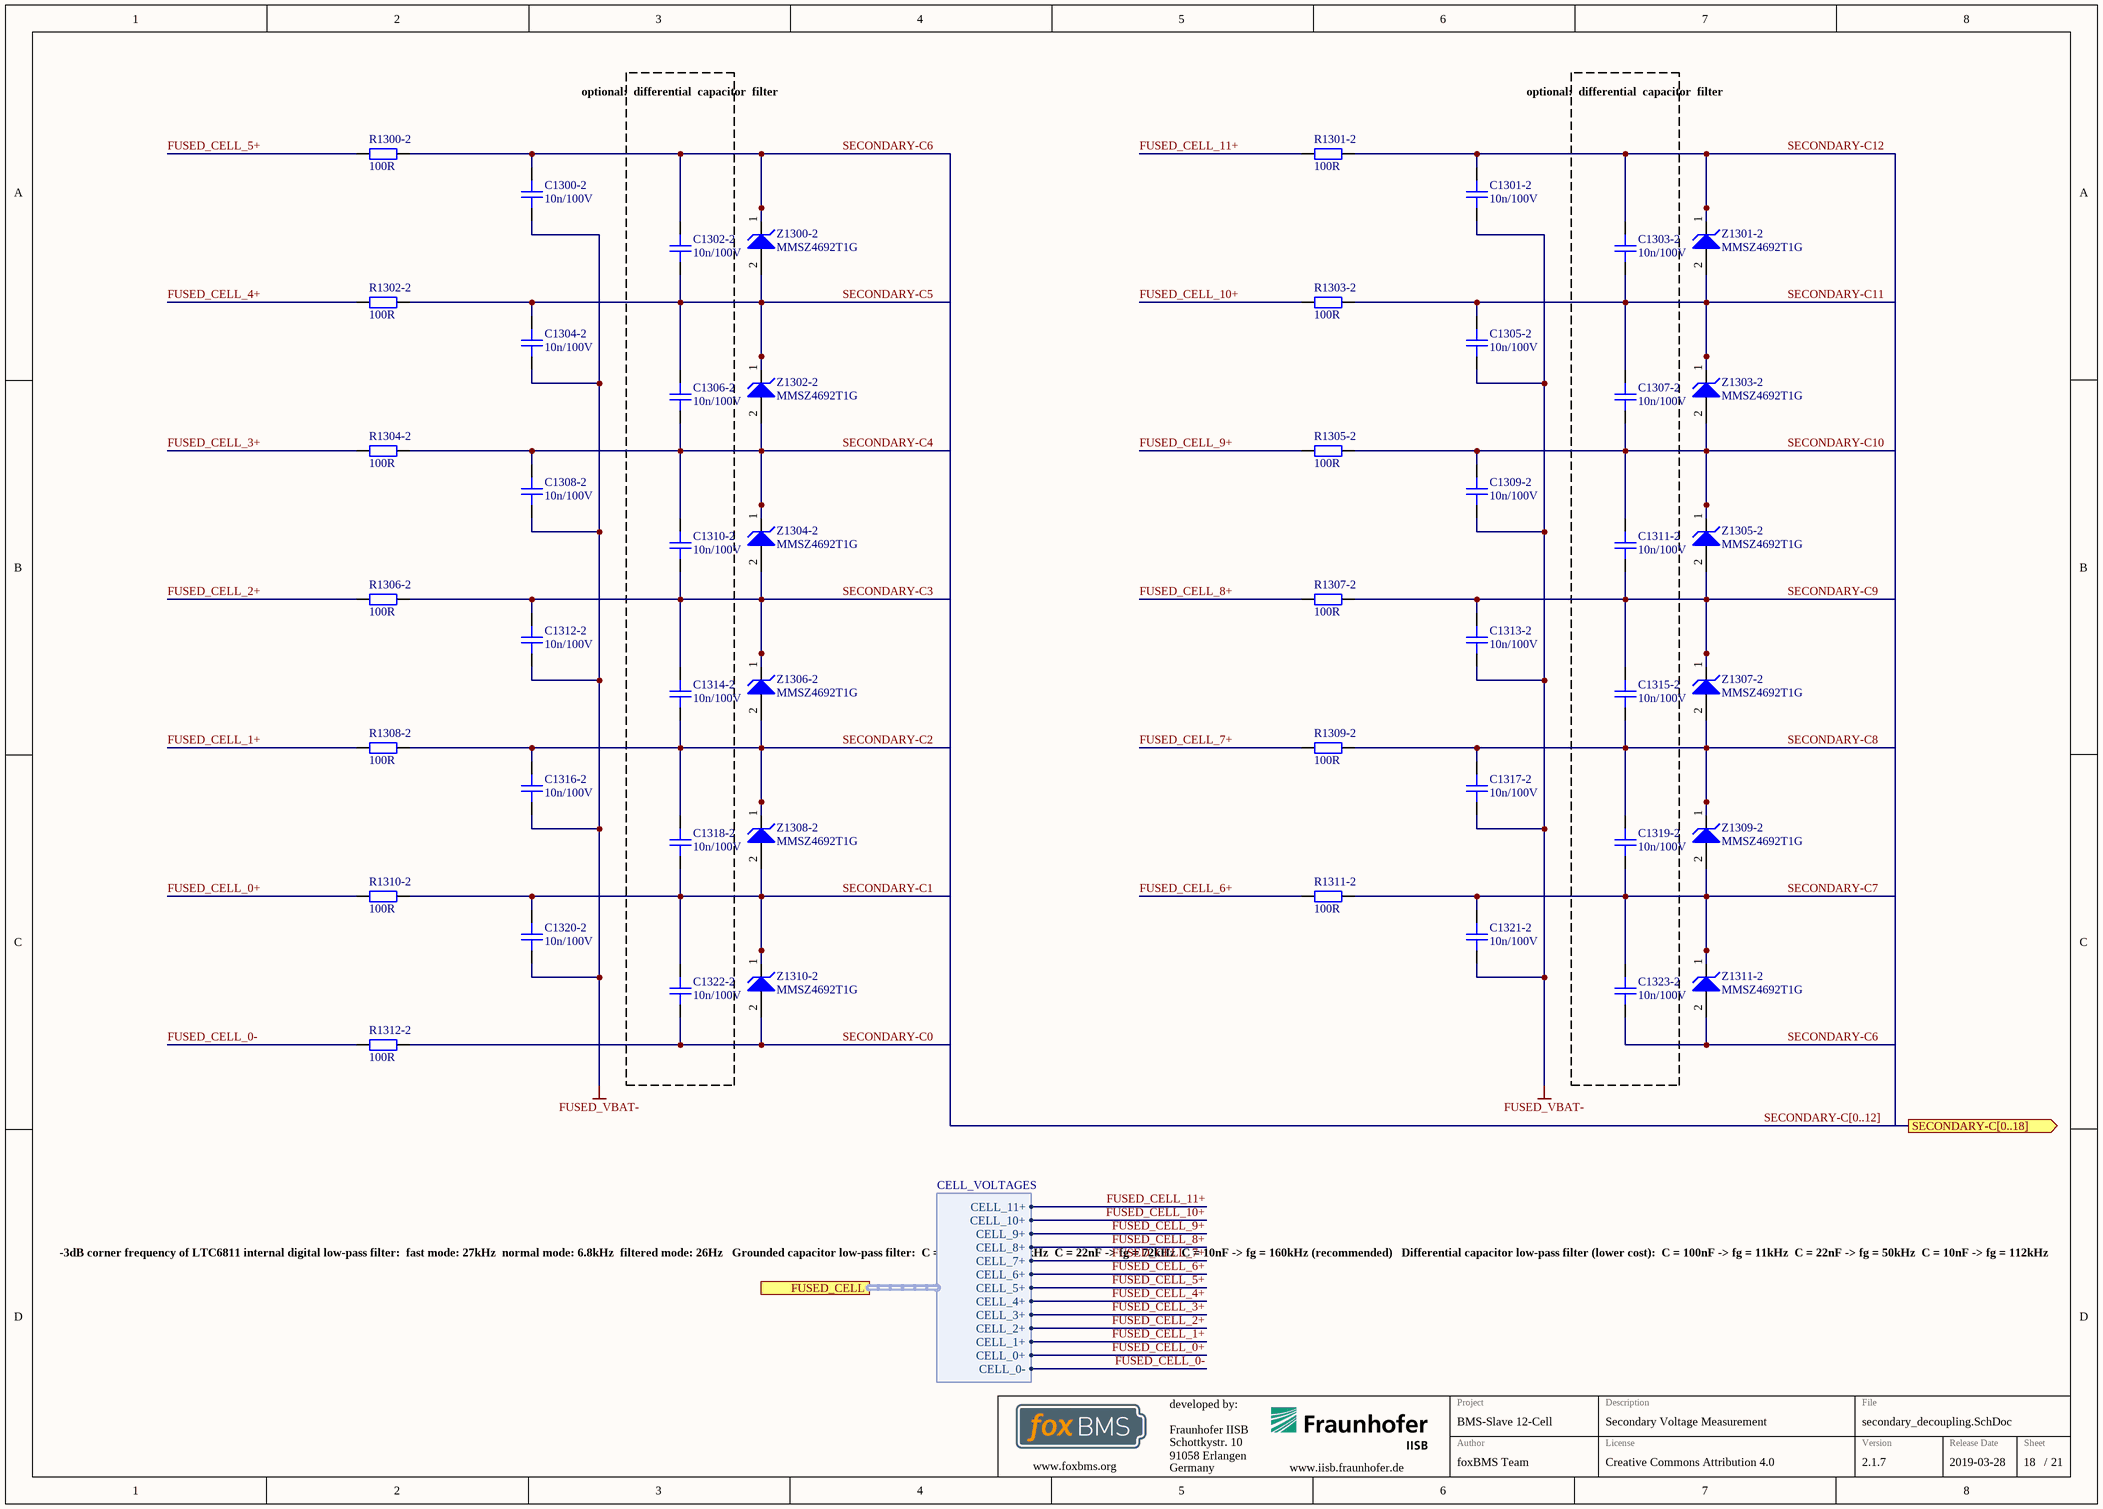
[diagram p3: secondary_decoupling.SchDoc]

### Parts
C1300-2  10n/100V  [CAPC1608X08N]
C1301-2  10n/100V  [CAPC1608X08N]
C1302-2  10n/100V  [CAPC1608X08N]
C1303-2  10n/100V  [CAPC1608X08N]
C1304-2  10n/100V  [CAPC1608X08N]
C1305-2  10n/100V  [CAPC1608X08N]
C1306-2  10n/100V  [CAPC1608X08N]
C1307-2  10n/100V  [CAPC1608X08N]
C1308-2  10n/100V  [CAPC1608X08N]
C1309-2  10n/100V  [CAPC1608X08N]
C1310-2  10n/100V  [CAPC1608X08N]
C1311-2  10n/100V  [CAPC1608X08N]
C1312-2  10n/100V  [CAPC1608X08N]
C1313-2  10n/100V  [CAPC1608X08N]
C1314-2  10n/100V  [CAPC1608X08N]
C1315-2  10n/100V  [CAPC1608X08N]
C1316-2  10n/100V  [CAPC1608X08N]
C1317-2  10n/100V  [CAPC1608X08N]
C1318-2  10n/100V  [CAPC1608X08N]
C1319-2  10n/100V  [CAPC1608X08N]
C1320-2  10n/100V  [CAPC1608X08N]
C1321-2  10n/100V  [CAPC1608X08N]
C1322-2  10n/100V  [CAPC1608X08N]
C1323-2  10n/100V  [CAPC1608X08N]
R1300-2  100R  [RESC1608X05N]
R1301-2  100R  [RESC1608X05N]
R1302-2  100R  [RESC1608X05N]
R1303-2  100R  [RESC1608X05N]
R1304-2  100R  [RESC1608X05N]
R1305-2  100R  [RESC1608X05N]
R1306-2  100R  [RESC1608X05N]
R1307-2  100R  [RESC1608X05N]
R1308-2  100R  [RESC1608X05N]
R1309-2  100R  [RESC1608X05N]
R1310-2  100R  [RESC1608X05N]
R1311-2  100R  [RESC1608X05N]
R1312-2  100R  [RESC1608X05N]
Z1300-2  MMSZ4692T1G  [ONSC-SOD-123-2-425-04_V]
Z1301-2  MMSZ4692T1G  [ONSC-SOD-123-2-425-04_V]
Z1302-2  MMSZ4692T1G  [ONSC-SOD-123-2-425-04_V]
Z1303-2  MMSZ4692T1G  [ONSC-SOD-123-2-425-04_V]
Z1304-2  MMSZ4692T1G  [ONSC-SOD-123-2-425-04_V]
Z1305-2  MMSZ4692T1G  [ONSC-SOD-123-2-425-04_V]
Z1306-2  MMSZ4692T1G  [ONSC-SOD-123-2-425-04_V]
Z1307-2  MMSZ4692T1G  [ONSC-SOD-123-2-425-04_V]
Z1308-2  MMSZ4692T1G  [ONSC-SOD-123-2-425-04_V]
Z1309-2  MMSZ4692T1G  [ONSC-SOD-123-2-425-04_V]
Z1310-2  MMSZ4692T1G  [ONSC-SOD-123-2-425-04_V]
Z1311-2  MMSZ4692T1G  [ONSC-SOD-123-2-425-04_V]

### Blocks framed on the sheet
optional: / differential / capacitor / filter: C1302-2 C1306-2 C1310-2 C1314-2 C1318-2 C1322-2
optional: / differential / capacitor / filter: C1303-2 C1307-2 C1311-2 C1315-2 C1319-2 C1323-2

### Ports
FUSED_CELL (harness CELL_VOLTAGES), SECONDARY-C[0..18] (out)

### Harnesses
CELL_VOLTAGES: CELL_0-, CELL_0+, CELL_1+, CELL_10+, CELL_11+, CELL_2+, CELL_3+, CELL_4+, CELL_5+, CELL_6+, CELL_7+, CELL_8+, CELL_9+

### Nets
FUSED_VBAT-: C1300-2.2 C1301-2.2 C1304-2.2 C1305-2.2 C1308-2.2 C1309-2.2 C1312-2.2 C1313-2.2 C1316-2.2 C1317-2.2 C1320-2.2 C1321-2.2
FUSED_CELL_0+: R1310-2.1 ; port FUSED_CELL.CELL_0+
FUSED_CELL_0-: R1312-2.1 ; port FUSED_CELL.CELL_0-
FUSED_CELL_1+: R1308-2.1 ; port FUSED_CELL.CELL_1+
FUSED_CELL_2+: R1306-2.1 ; port FUSED_CELL.CELL_2+
FUSED_CELL_3+: R1304-2.1 ; port FUSED_CELL.CELL_3+
FUSED_CELL_4+: R1302-2.1 ; port FUSED_CELL.CELL_4+
FUSED_CELL_5+: R1300-2.1 ; port FUSED_CELL.CELL_5+
FUSED_CELL_6+: R1311-2.1 ; port FUSED_CELL.CELL_6+
FUSED_CELL_7+: R1309-2.1 ; port FUSED_CELL.CELL_7+
FUSED_CELL_8+: R1307-2.1 ; port FUSED_CELL.CELL_8+
FUSED_CELL_9+: R1305-2.1 ; port FUSED_CELL.CELL_9+
FUSED_CELL_10+: R1303-2.1 ; port FUSED_CELL.CELL_10+
FUSED_CELL_11+: R1301-2.1 ; port FUSED_CELL.CELL_11+
SECONDARY-C0: C1322-2.2 R1312-2.2 Z1310-2.2(A)
SECONDARY-C1: C1318-2.2 C1320-2.1 C1322-2.1 R1310-2.2 Z1308-2.2(A) Z1310-2.1(K)
SECONDARY-C2: C1314-2.2 C1316-2.1 C1318-2.1 R1308-2.2 Z1306-2.2(A) Z1308-2.1(K)
SECONDARY-C3: C1310-2.2 C1312-2.1 C1314-2.1 R1306-2.2 Z1304-2.2(A) Z1306-2.1(K)
SECONDARY-C4: C1306-2.2 C1308-2.1 C1310-2.1 R1304-2.2 Z1302-2.2(A) Z1304-2.1(K)
SECONDARY-C5: C1302-2.2 C1304-2.1 C1306-2.1 R1302-2.2 Z1300-2.2(A) Z1302-2.1(K)
SECONDARY-C6: C1300-2.1 C1302-2.1 C1323-2.2 R1300-2.2 Z1300-2.1(K) Z1311-2.2(A)
SECONDARY-C7: C1319-2.2 C1321-2.1 C1323-2.1 R1311-2.2 Z1309-2.2(A) Z1311-2.1(K)
SECONDARY-C8: C1315-2.2 C1317-2.1 C1319-2.1 R1309-2.2 Z1307-2.2(A) Z1309-2.1(K)
SECONDARY-C9: C1311-2.2 C1313-2.1 C1315-2.1 R1307-2.2 Z1305-2.2(A) Z1307-2.1(K)
SECONDARY-C10: C1307-2.2 C1309-2.1 C1311-2.1 R1305-2.2 Z1303-2.2(A) Z1305-2.1(K)
SECONDARY-C11: C1303-2.2 C1305-2.1 C1307-2.1 R1303-2.2 Z1301-2.2(A) Z1303-2.1(K)
SECONDARY-C12: C1301-2.1 C1303-2.1 R1301-2.2 Z1301-2.1(K)

### Buses and harness runs
bus SECONDARY-C[0..12] = port SECONDARY-C[0..18]

### Notes on the sheet
- -3dB corner frequency of LTC6811 internal digital low-pass filter:
  fast mode: 27kHz
  normal mode: 6.8kHz
  filtered mode: 26Hz
  Grounded capacitor low-pass filter:
  C = 100nF -> fg = 16kHz
  C = 22nF -> fg = 72kHz
  C = 10nF -> fg = 160kHz (recommended)
  Differential capacitor low-pass filter (lower cost):
  C = 100nF -> fg = 11kHz
  C = 22nF -> fg = 50kHz
  C = 10nF -> fg = 112kHz
- Fraunhofer IISB
- Schottkystr. 10
- developed by:
- 91058 Erlangen
- Germany
- Author
- Project
- License
- Description
- File
- Version
- Release Date
- Sheet
- www.foxbms.org
- www.iisb.fraunhofer.de
- foxBMS Team
- /

### Library data of the parts
C1300-2 C1301-2 C1302-2 C1303-2 C1304-2 C1305-2 C1306-2 C1307-2 C1308-2 C1309-2 C1310-2 C1311-2 C1312-2 C1313-2 C1314-2 C1315-2 C1316-2 C1317-2 C1318-2 C1319-2 C1320-2 C1321-2 C1322-2 C1323-2 = gen_C_ceramic_10n_100V_X7R_0603: as C1300-1 on sheet primary_decoupling; Part Number: gen_C_ceramic_10n_100V_X7R_0603; Supplier 1: Farnell; Supplier Part Number 1: 1301715; Supplier 2: Farnell; Supplier 3: Farnell; Supplier Part Number 2: 2821192; Supplier Part Number 3: 2210878
R1300-2 R1301-2 R1302-2 R1303-2 R1304-2 R1305-2 R1306-2 R1307-2 R1308-2 R1309-2 R1310-2 R1311-2 R1312-2 = gen_R_100R_0603: as R1300-1 on sheet primary_decoupling; Part Number: gen_R_100R_0603; Operating Temperature: -55°C - +155°C; Resistance: 100R; Series: E24, E96; PnP Value: 100R; Supplier 1: Farnell; Supplier Part Number 1: 1469752
Z1300-2 Z1301-2 Z1302-2 Z1303-2 Z1304-2 Z1305-2 Z1306-2 Z1307-2 Z1308-2 Z1309-2 Z1310-2 Z1311-2 = CMP-1060-00434-1: as Z1300-1 on sheet primary_decoupling; ComponentLink2URL: http://www.onsemi.com/pub_link/Collateral/MMSZ4678T1-D.PDF; Mounting Technology: Surface Mount; DatasheetVersion: Rev. 9; ComponentLink1Description: Manufacturer URL; ComponentLink3URL: http://www.onsemi.com/pub_link/Collateral/425-04.PDF; PackageReference: SOD-123-2-425-04; ComponentLink2Description: Datasheet; RoHS: Pb-Free; Packing: Tape and Reel; ComponentLink1URL: http://www.onsemi.com/; PackageDescription: 2-Pin SOD, Body 1.6 x 2.69 mm; ComponentLink3Description: Package Specification; PartNumber: MMSZ4692T1G; PackageVersion: Rev. G, 10/2009

## Sheet ext_supply.SchDoc: foxBMS BMS-Slave 12-Cell
size A3; DocumentNumber: 6; SheetNumber: 6; SheetTotal: 21; AUTHOR: Fraunhofer IISB foxBMS Team; SheetDescription: External Power Supply
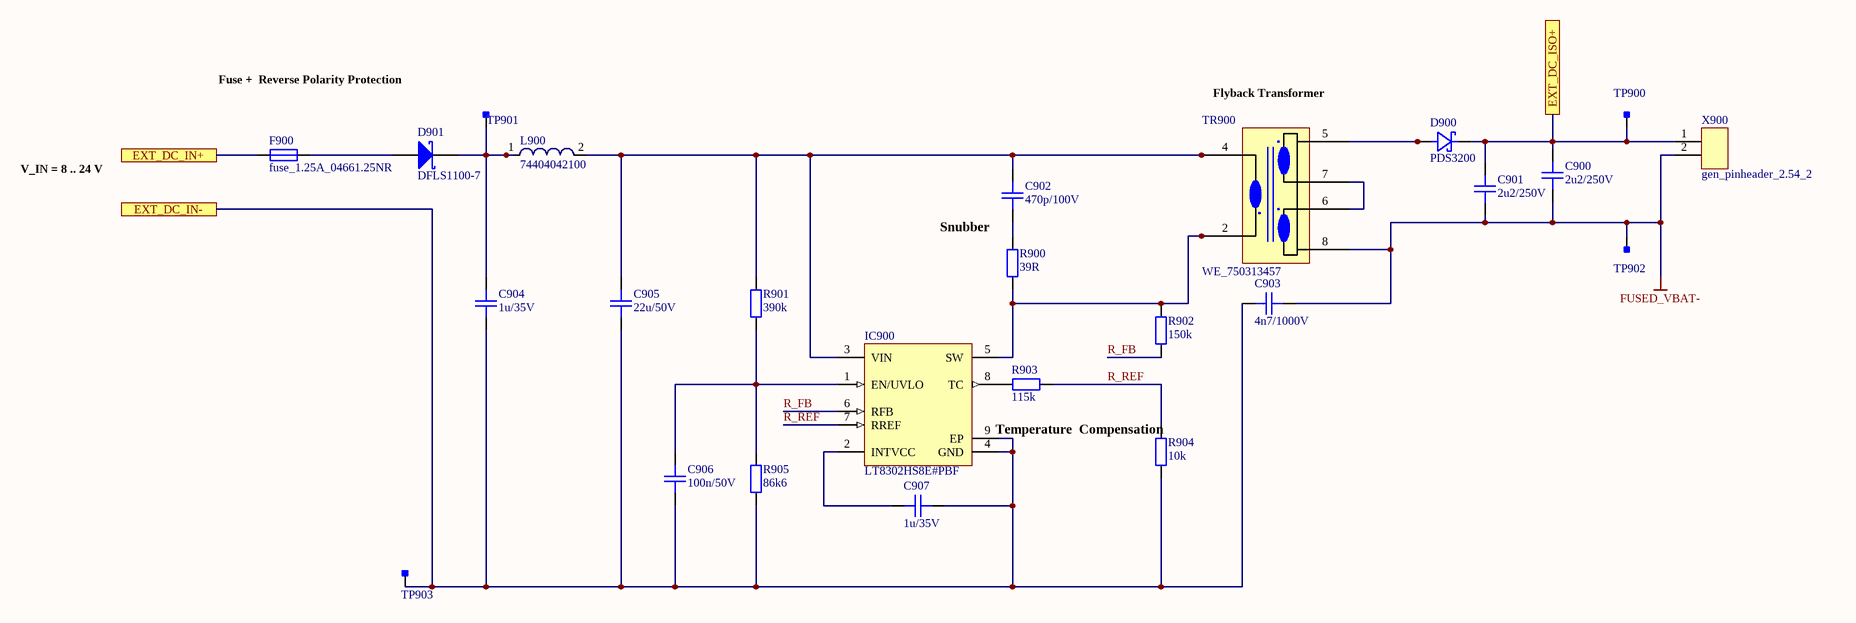
[diagram p4: ext_supply.SchDoc]

### Parts
C900  2u2/250V  [CAPC2220(5750)230_N]
C901  2u2/250V  [CAPC2220(5750)230_N]
C902  470p/100V  [CAPC2012X14N]
C903  4n7/1000V  [CAPC4532X16N]
C904  1u/35V  [CAPC1608X08N]
C905  22u/50V  [CAPC2220(5750)230_N]
C906  100n/50V  [CAPC1608X08N]
C907  1u/35V  [CAPC1608X08N]
D900  PDS3200  [PowerDI5]
D901  DFLS1100-7  [DIOD-POWERDI123-2_V]
F900  fuse_1.25A_04661.25NR  [LITTLEFUSE_466]
IC900  LT8302HS8E#PBF  [LT-S8E-8_V]
L900  74404042100  [WE-LQS 4018]
R900  39R  [RESC2012X05N]
R901  390k  [RESC1608X05N]
R902  150k  [RESC1608X05N]
R903  115k  [RESC1608X05N]
R904  10k  [RESC1608X05N]
R905  86k6  [RESC1608X05N]
TP900  Testpoint_Square  [Testpoint_S1]  (value not drawn)  (no BOM)
TP901  Testpoint_Square  [Testpoint_S1]  (value not drawn)  (no BOM)
TP902  Testpoint_Square  [Testpoint_S1]  (value not drawn)  (no BOM)
TP903  Testpoint_Square  [Testpoint_S1]  (value not drawn)  (no BOM)
TR900  WE_750313457  [WE_750313457]
X900  gen_pinheader_2.54_2  [Pinheader_2.54_2]

### Ports
EXT_DC_IN+, EXT_DC_IN-, EXT_DC_ISO+

### Nets
FUSED_VBAT-: C900.1 C901.1 C903.2 TP902.1 TR900.8 X900.2
EXT_DC_IN+: F900.1 ; port EXT_DC_IN+
EXT_DC_IN-: C903.1 C904.2 C905.1 C906.1 C907.1 IC900.4(GND) IC900.9(EP) R904.1 R905.1 TP903.1 ; port EXT_DC_IN-
EXT_DC_ISO+: C900.2 C901.2 D900.1(C) TP900.1 X900.1 ; port EXT_DC_ISO+
R_FB: IC900.6(RFB) R902.1
R_REF: IC900.7(RREF) R903.2 R904.2
NetC902_1: C902.1 R900.2
NetC902_2: C902.2 C905.2 IC900.3(VIN) L900.2 R901.2 TR900.3 TR900.4
NetC904_1: C904.1 D901.2(K) L900.1 TP901.1
NetC906_2: C906.2 IC900.1(EN/UVLO) R901.1 R905.2
NetC907_2: C907.2 IC900.2(INTVCC)
NetD900_2: D900.2(A) D900.3(A) TR900.5
NetD901_1: D901.1(A) F900.2
NetIC900_5: IC900.5(SW) R900.1 R902.2 TR900.1 TR900.2
NetIC900_8: IC900.8(TC) R903.1
NetTR900_6: TR900.6 TR900.7

### Notes on the sheet
- Fuse +
  Reverse Polarity Protection
- (near TR900) Flyback Transformer
- V_IN = 8 .. 24 V
- Snubber
- (near R904) Temperature
  Compensation
- Fraunhofer IISB
- Schottkystr. 10
- developed by:
- 91058 Erlangen
- Germany
- Author
- Project
- License
- Description
- File
- Version
- Release Date
- Sheet
- www.foxbms.org
- www.iisb.fraunhofer.de
- foxBMS Team
- /

### Library data of the parts
C900 C901 = gen_C_ceramic_2u2_250V_X7R_2220: MLCC; Capacitance: 2u2; Rated Voltage: 250V; Dielectric: X7R; Case EIA: 2220; Case Metric: 5750; Automotive Qualified: True; Part Number: gen_C_ceramic_2u2_250V_X7R_2220; Supplier 1: Digikey; Supplier Part Number 1: 445-7997-2-ND
C902 = gen_C_ceramic_470p_100V_X7R_0805: MLCC; Capacitance: 470p; Rated Voltage: 100V; Dielectric: X7R; Case EIA: 0805; Case Metric: 2012; Automotive Qualified: False; Part Number: gen_C_ceramic_470p_100V_X7R_0805; Supplier 1: Farnell; Supplier Part Number 1: 1759283
C903 = gen_C_ceramic_4n7_1000V_X7R_1812: MLCC; Capacitance: 4n7; Rated Voltage: 1000V; Dielectric: X7R; Case EIA: 1812; Case Metric: 4532; Automotive Qualified: False; Part Number: gen_C_ceramic_4n7_1000V_X7R_1812; Supplier 1: Farnell; Supplier Part Number 1: 1702159
C904 C907 = gen_C_ceramic_1u_35V_X7R_0603: MLCC; Capacitance: 1u; Rated Voltage: 35V; Dielectric: X7R; Case EIA: 0603; Case Metric: 1608; PnP Package: C_0603_10; PnP Value: 1uF/35V/X7R; PnP equipped: x; Automotive Qualified: False; Part Number: gen_C_ceramic_1u_35V_X7R_0603; Supplier 1: Farnell; Supplier Part Number 1: 1907508
C905 = gen_C_ceramic_22u_50V_X7R_2220_stacked: MLCC; Capacitance: 22u; Rated Voltage: 50V; Dielectric: X7R; Case EIA: 2220; Case Metric: 5750; Automotive Qualified: True; Part Number: gen_C_ceramic_22u_50V_X7R_2220_stacked; Supplier 1: Digikey; Supplier Part Number 1: 399-5797-1-ND
C906 = gen_C_ceramic_100n_50V_X7R_0603: MLCC; Capacitance: 100n; Rated Voltage: 50V; Dielectric: X7R; Case EIA: 0603; Case Metric: 1608; PnP Package: C_0603_10; PnP Value: 100n/50V/X7R; PnP equipped: x; Automotive Qualified: False; Part Number: gen_C_ceramic_100n_50V_X7R_0603; Supplier 1: Farnell; Supplier Part Number 1: 2525267; Supplier 2: Digikey; Supplier Part Number 2: 490-6049-1-ND
D900 = PDS3200-13: Schottky Diode 3A 200V 780mV; Manufacturer: DIODES Inc; Automotive Qualified: True; Part Number: PDS3200-13; Part Name: PDS3200; Operating Temperature: -65°C - +150°C; Breakdown Voltage: 200V; Continuous Forward Current: 3A; ComponentLink1Description: Datasheet; ComponentLink1URL: http://www.farnell.com/datasheets/2238298.pdf; Supplier 1: Farnell; Supplier Part Number 1: 1713904
D901 = CMP-2000-05099-1: 1 A High Voltage Schottky Barrier Rectifier, 0.62 V, -55 to 175 degC, 2- Pin POWERDI123, Pb-Free, Tape and Reel; Manufacturer: Diodes Inc; Average Rectified Current-Max: 1A; Peak Current-Max: 40A; Forward Voltage: 0.77V; Reverse Current-Max: 1µA; Reverse Voltage-Max [Vrrm]: 100V; Datasheet Version: Sep-14; Datasheet URL: https://datasheet.ciiva.com/15144/getdatasheetpartid-44146-15144126.pdf; Manufacturer URL: http://www.diodes.com/
F900 = fuse_1.25A_04661.25NR: Fuse, Surface Mount, 466 Series, 1.25 A, 63 VAC, 63 VDC, Very Fast Acting, 1206; Manufacturer: Littlefuse; Automotive Qualified: False; Part Number: fuse_1.25A_04661.25NR; Operating Temperature: -55°C - +90°C; ComponentLink1Description: Datasheet; ComponentLink1URL: http://www.farnell.com/datasheets/1796765.pdf; Supplier 1: Farnell; Supplier Part Number 1: 1596526
IC900 = CMP-0492-02715-1: Micropower No-Opto Isolated Flyback Converter, 2.8 to 42 V, -40 to 150 degC, 8-Pin SOIC (S8E), RoHS, Tube; PartNumber: LT8302; Output Current: 3.6 A; Number of Outputs: 1; VIN Min: 2.8 V; VIN Max: 42 V; ComponentLink2Description: Datasheet; Temperature Min: -40 degC; PackageDescription: 8-Pin Plastic Small Outline Integrated Circuit Package, Body 4.90 x 3.90 mm, Pitch 1.27 mm; Temperature Max: 150 degC; ComponentLink1URL: http://www.linear.com/; ComponentLink3URL: http://cds.linear.com/docs/en/packaging/05081857_A_S8E.pdf; PackageVersion: Rev. A, 10/2013; Packing: Tube; RoHS: TRUE; DatasheetVersion: Rev. A; ComponentLink2URL: http://cds.linear.com/docs/en/datasheet/8302fa.pdf; Mounting Technology: Surface Mount; ComponentLink1Description: Manufacturer URL; ComponentLink3Description: Package Specification
L900 = CMP-1354-00028-1: WE-LQS SMD Power Inductor, L=10 µH; Manufacturer: Wuerth Elektronik; Inductance: 10 ÂµH; ComponentLink2URL: http://katalog.we-online.de/pbs/datasheet/74404042100.pdf; PartNumber: 74404042100; ComponentLink2Description: Datasheet; PackageReference: WE-LQS 4018; ComponentLink1URL: http://www.we-online.com; ComponentLink1Description: Manufacturer URL
R900 = gen_R_39R_0805: SMD Resistor 39R 0805; Tolerance: 1%; Power: 0.125W; Case EIA: 0805; Case Metric: 2012; Maximum Working Voltage: 150V; PnP Package: R_0805; Automotive Qualified: False; Part Number: gen_R_39R_0805; Operating Temperature: -55°C - +155°C; Resistance: 39R; Series: E24; PnP Value: 39R; Supplier 1: Farnell; Supplier Part Number 1: 1750736
R901 = gen_R_390k_0603: SMD Resistor 390k 0603; Tolerance: 1%; Power: 0.1W; Case EIA: 0603; Case Metric: 1608; Maximum Working Voltage: 75V; PnP Package: R_0603; Automotive Qualified: False; Part Number: gen_R_390k_0603; Operating Temperature: -55°C - +155°C; Resistance: 390k; Series: E24; PnP Value: 390k; Supplier 1: Farnell; Supplier Part Number 1: 2303278
R902 = gen_R_150k_0603: SMD Resistor 150k 0603; Tolerance: 1%; Power: 0.1W; Case EIA: 0603; Case Metric: 1608; Maximum Working Voltage: 75V; PnP Package: R_0603; Automotive Qualified: False; Part Number: gen_R_150k_0603; Operating Temperature: -55°C - +155°C; Resistance: 150k; Series: E24, E96; PnP Value: 150k
R903 = gen_R_115k_0603: SMD Resistor 115k 0603; Tolerance: 1%; Power: 0.1W; Case EIA: 0603; Case Metric: 1608; Maximum Working Voltage: 75V; PnP Package: R_0603; Automotive Qualified: False; Part Number: gen_R_115k_0603; Operating Temperature: -55°C - +155°C; Resistance: 115k; Series: E96; PnP Value: 115k; Supplier 1: Farnell; Supplier Part Number 1: 2073367
R904 = gen_R_10k_0603: SMD Resistor 10k 0603; Tolerance: 1%; Power: 0.1W; Case EIA: 0603; Case Metric: 1608; Maximum Working Voltage: 75V; PnP Package: R_0603; Automotive Qualified: False; Part Number: gen_R_10k_0603; Operating Temperature: -55°C - +155°C; Resistance: 10k; Series: E24, E96; PnP Value: 10k; Supplier 1: Farnell; Supplier Part Number 1: 2073349
R905 = gen_R_86k6_0603: SMD Resistor 86k6 0603; Tolerance: 1%; Power: 0.1W; Case EIA: 0603; Case Metric: 1608; Maximum Working Voltage: 75V; PnP Package: R_0603; Automotive Qualified: False; Part Number: gen_R_86k6_0603; Operating Temperature: -55°C - +155°C; Resistance: 86k6; Series: E96; PnP Value: 86k6; Supplier 1: Farnell; Supplier Part Number 1: 2059490
TP900-TP903 = Testpoint_Square: Testpoint, square; Part Number: Testpoint_Square
TR900 = WE_750313457: MID-FLYLT Flyback Transformers for Linear Technology; Manufacturer: Würth Elektronik; Automotive Qualified: False; Part Number: WE_750313457; ComponentLink1Description: Datasheet; ComponentLink1URL: http://katalog.we-online.de/ctm/datasheet/750313457.pdf; ComponentLink2Description: Website; ComponentLink2URL: http://katalog.we-online.de/en/ctm/MID-FLYLT/750313457; Supplier 1: Digikey; Supplier Part Number 1: 1297-1136-1-ND
X900 = gen_pinheader_2.54_2: Standard Pinheader, THD, gerade, 2.54mm; Circuits: 2; Rated Voltage: 250V; Rated Current: 3A; Automotive Qualified: False; Part Number: gen_pinheader_2.54_2; Part Name: PinHeader; Operating Temperature: −40 °C - +105 °C; Supplier 1: Farnell; Supplier Part Number 1: 2025248

## Sheet connectors.SchDoc: foxBMS BMS-Slave 12-Cell
size A3; DocumentNumber: 4; SheetNumber: 4; SheetTotal: 21; AUTHOR: Fraunhofer IISB foxBMS Team; SheetDescription: Connectors
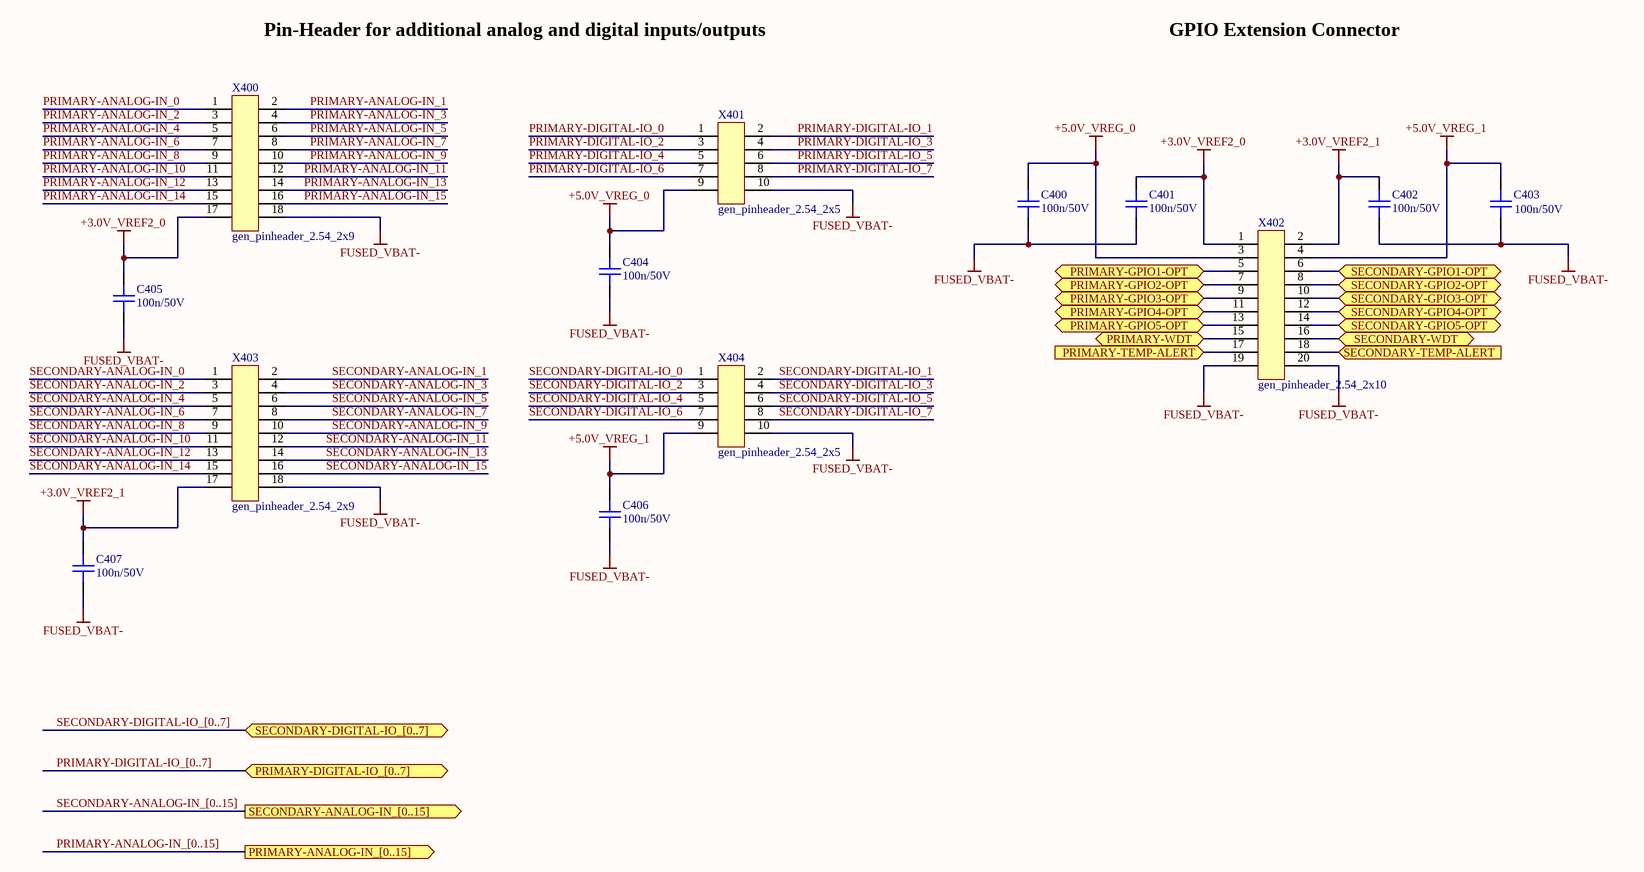
[diagram p5: connectors.SchDoc]

### Parts
C400  100n/50V  [CAPC1608X08N]
C401  100n/50V  [CAPC1608X08N]
C402  100n/50V  [CAPC1608X08N]
C403  100n/50V  [CAPC1608X08N]
C404  100n/50V  [CAPC1608X08N]
C405  100n/50V  [CAPC1608X08N]
C406  100n/50V  [CAPC1608X08N]
C407  100n/50V  [CAPC1608X08N]
X400  gen_pinheader_2.54_2x9  [Pinheader_2.54_2x9]
X401  gen_pinheader_2.54_2x5  [Pinheader_2.54_2x5]
X402  gen_pinheader_2.54_2x10  [Pinheader_2.54_2x10]
X403  gen_pinheader_2.54_2x9  [Pinheader_2.54_2x9]
X404  gen_pinheader_2.54_2x5  [Pinheader_2.54_2x5]

### Ports
PRIMARY-ANALOG-IN_[0..15] (out), PRIMARY-DIGITAL-IO_[0..7] (bidir), PRIMARY-GPIO1-OPT (bidir), PRIMARY-GPIO2-OPT (bidir), PRIMARY-GPIO3-OPT (bidir), PRIMARY-GPIO4-OPT (bidir), PRIMARY-GPIO5-OPT (bidir), PRIMARY-TEMP-ALERT (in), PRIMARY-WDT (bidir), SECONDARY-ANALOG-IN_[0..15] (out), SECONDARY-DIGITAL-IO_[0..7] (bidir), SECONDARY-GPIO1-OPT (bidir), SECONDARY-GPIO2-OPT (bidir), SECONDARY-GPIO3-OPT (bidir), SECONDARY-GPIO4-OPT (bidir), SECONDARY-GPIO5-OPT (bidir), SECONDARY-TEMP-ALERT (in), SECONDARY-WDT (bidir)

### Nets
+3.0V_VREF2_0: C401.2 C405.2 X400.17 X402.1
+3.0V_VREF2_1: C402.2 C407.2 X402.2 X403.17
+5.0V_VREG_0: C400.2 C404.2 X401.9 X402.3
+5.0V_VREG_1: C403.2 C406.2 X402.4 X404.9
FUSED_VBAT-: C400.1 C401.1 C402.1 C403.1 C404.1 C405.1 C406.1 C407.1 X400.18 X401.10 X402.19 X402.20 X403.18 X404.10
PRIMARY-ANALOG-IN_0: X400.1
PRIMARY-ANALOG-IN_1: X400.2
PRIMARY-ANALOG-IN_2: X400.3
PRIMARY-ANALOG-IN_3: X400.4
PRIMARY-ANALOG-IN_4: X400.5
PRIMARY-ANALOG-IN_5: X400.6
PRIMARY-ANALOG-IN_6: X400.7
PRIMARY-ANALOG-IN_7: X400.8
PRIMARY-ANALOG-IN_8: X400.9
PRIMARY-ANALOG-IN_9: X400.10
PRIMARY-ANALOG-IN_10: X400.11
PRIMARY-ANALOG-IN_11: X400.12
PRIMARY-ANALOG-IN_12: X400.13
PRIMARY-ANALOG-IN_13: X400.14
PRIMARY-ANALOG-IN_14: X400.15
PRIMARY-ANALOG-IN_15: X400.16
PRIMARY-DIGITAL-IO_0: X401.1
PRIMARY-DIGITAL-IO_1: X401.2
PRIMARY-DIGITAL-IO_2: X401.3
PRIMARY-DIGITAL-IO_3: X401.4
PRIMARY-DIGITAL-IO_4: X401.5
PRIMARY-DIGITAL-IO_5: X401.6
PRIMARY-DIGITAL-IO_6: X401.7
PRIMARY-DIGITAL-IO_7: X401.8
PRIMARY-GPIO1-OPT: X402.5 ; port PRIMARY-GPIO1-OPT
PRIMARY-GPIO2-OPT: X402.7 ; port PRIMARY-GPIO2-OPT
PRIMARY-GPIO3-OPT: X402.9 ; port PRIMARY-GPIO3-OPT
PRIMARY-GPIO4-OPT: X402.11 ; port PRIMARY-GPIO4-OPT
PRIMARY-GPIO5-OPT: X402.13 ; port PRIMARY-GPIO5-OPT
PRIMARY-TEMP-ALERT: X402.17 ; port PRIMARY-TEMP-ALERT
PRIMARY-WDT: X402.15 ; port PRIMARY-WDT
SECONDARY-ANALOG-IN_0: X403.1
SECONDARY-ANALOG-IN_1: X403.2
SECONDARY-ANALOG-IN_2: X403.3
SECONDARY-ANALOG-IN_3: X403.4
SECONDARY-ANALOG-IN_4: X403.5
SECONDARY-ANALOG-IN_5: X403.6
SECONDARY-ANALOG-IN_6: X403.7
SECONDARY-ANALOG-IN_7: X403.8
SECONDARY-ANALOG-IN_8: X403.9
SECONDARY-ANALOG-IN_9: X403.10
SECONDARY-ANALOG-IN_10: X403.11
SECONDARY-ANALOG-IN_11: X403.12
SECONDARY-ANALOG-IN_12: X403.13
SECONDARY-ANALOG-IN_13: X403.14
SECONDARY-ANALOG-IN_14: X403.15
SECONDARY-ANALOG-IN_15: X403.16
SECONDARY-DIGITAL-IO_0: X404.1
SECONDARY-DIGITAL-IO_1: X404.2
SECONDARY-DIGITAL-IO_2: X404.3
SECONDARY-DIGITAL-IO_3: X404.4
SECONDARY-DIGITAL-IO_4: X404.5
SECONDARY-DIGITAL-IO_5: X404.6
SECONDARY-DIGITAL-IO_6: X404.7
SECONDARY-DIGITAL-IO_7: X404.8
SECONDARY-GPIO1-OPT: X402.6 ; port SECONDARY-GPIO1-OPT
SECONDARY-GPIO2-OPT: X402.8 ; port SECONDARY-GPIO2-OPT
SECONDARY-GPIO3-OPT: X402.10 ; port SECONDARY-GPIO3-OPT
SECONDARY-GPIO4-OPT: X402.12 ; port SECONDARY-GPIO4-OPT
SECONDARY-GPIO5-OPT: X402.14 ; port SECONDARY-GPIO5-OPT
SECONDARY-TEMP-ALERT: X402.18 ; port SECONDARY-TEMP-ALERT
SECONDARY-WDT: X402.16 ; port SECONDARY-WDT

### Buses and harness runs
bus PRIMARY-ANALOG-IN_[0..15] = port PRIMARY-ANALOG-IN_[0..15]
bus PRIMARY-DIGITAL-IO_[0..7] = port PRIMARY-DIGITAL-IO_[0..7]
bus SECONDARY-ANALOG-IN_[0..15] = port SECONDARY-ANALOG-IN_[0..15]
bus SECONDARY-DIGITAL-IO_[0..7] = port SECONDARY-DIGITAL-IO_[0..7]

### Notes on the sheet
- Pin-Header for additional analog and digital inputs/outputs
- GPIO Extension Connector
- Fraunhofer IISB
- Schottkystr. 10
- developed by:
- 91058 Erlangen
- Germany
- Author
- Project
- License
- Description
- File
- Version
- Release Date
- Sheet
- www.foxbms.org
- www.iisb.fraunhofer.de
- foxBMS Team
- /

### Library data of the parts
C400-C407 = gen_C_ceramic_100n_50V_X7R_0603: as C906 on sheet ext_supply; Part Number: gen_C_ceramic_100n_50V_X7R_0603; Supplier 1: Farnell; Supplier Part Number 1: 2525267; Supplier 2: Digikey; Supplier Part Number 2: 490-6049-1-ND
X400 X403 = gen_pinheader_2.54_2x9: Standard Pinheader, THD, gerade, 2.54mm, 2-reihig; Circuits: 18; Rated Voltage: 250V; Rated Current: 3A; Automotive Qualified: False; Part Number: gen_pinheader_2.54_2x9; Part Name: PinHeader; Operating Temperature: −40 °C - +105 °C; Supplier 1: Farnell; Supplier Part Number 1: 2025256
X401 X404 = gen_pinheader_2.54_2x5: Standard Pinheader, THD, gerade, 2.54mm, 2-reihig; Circuits: 10; Rated Voltage: 250V; Rated Current: 3A; Automotive Qualified: False; Part Number: gen_pinheader_2.54_2x5; Part Name: PinHeader; Operating Temperature: −40 °C - +105 °C; Supplier 1: Farnell; Supplier Part Number 1: 2578720
X402 = gen_pinheader_2.54_2x10: Standard Pinheader, THD, gerade, 2.54mm, 2-reihig; Circuits: 20; Rated Voltage: 250V; Rated Current: 3A; Automotive Qualified: False; Part Number: gen_pinheader_2.54_2x10; Part Name: PinHeader; Operating Temperature: −40 °C - +105 °C; Supplier 1: Farnell; Supplier Part Number 1: 2025257